# EAGLE board Retro_Lite_CM5_IO_X2.2 (EAGLE 9.6.1), part 1 of 8
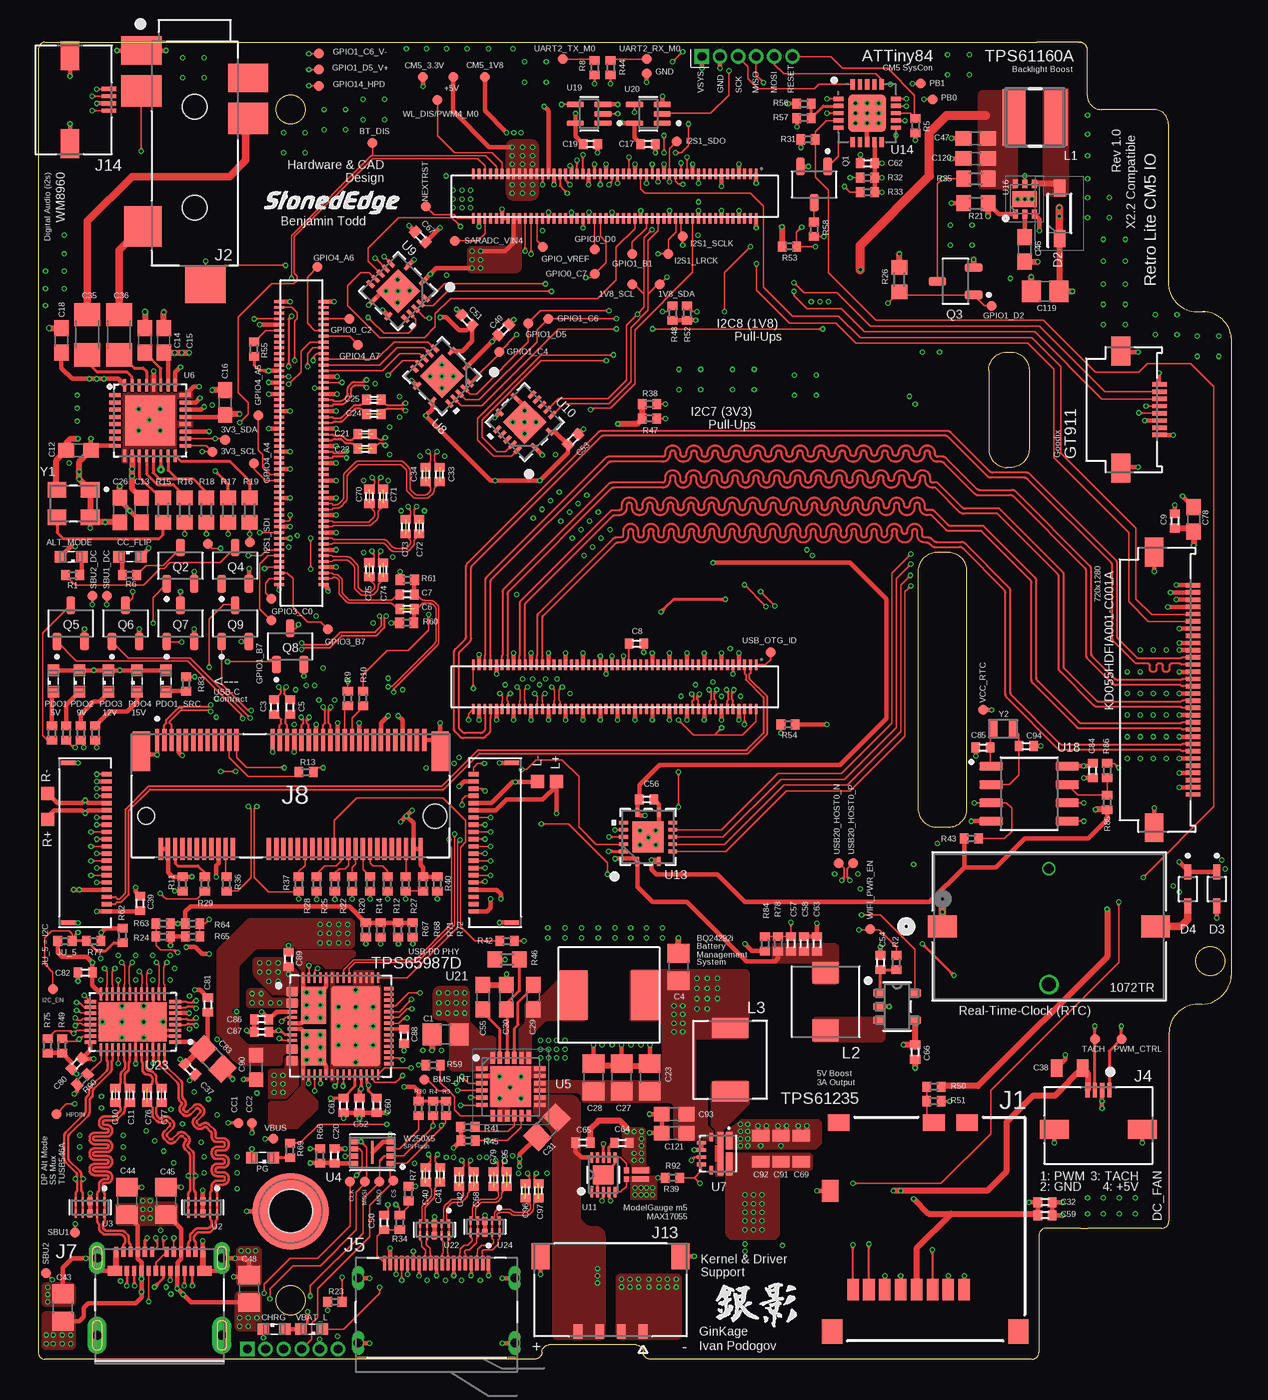
[diagram p10: board, top side]
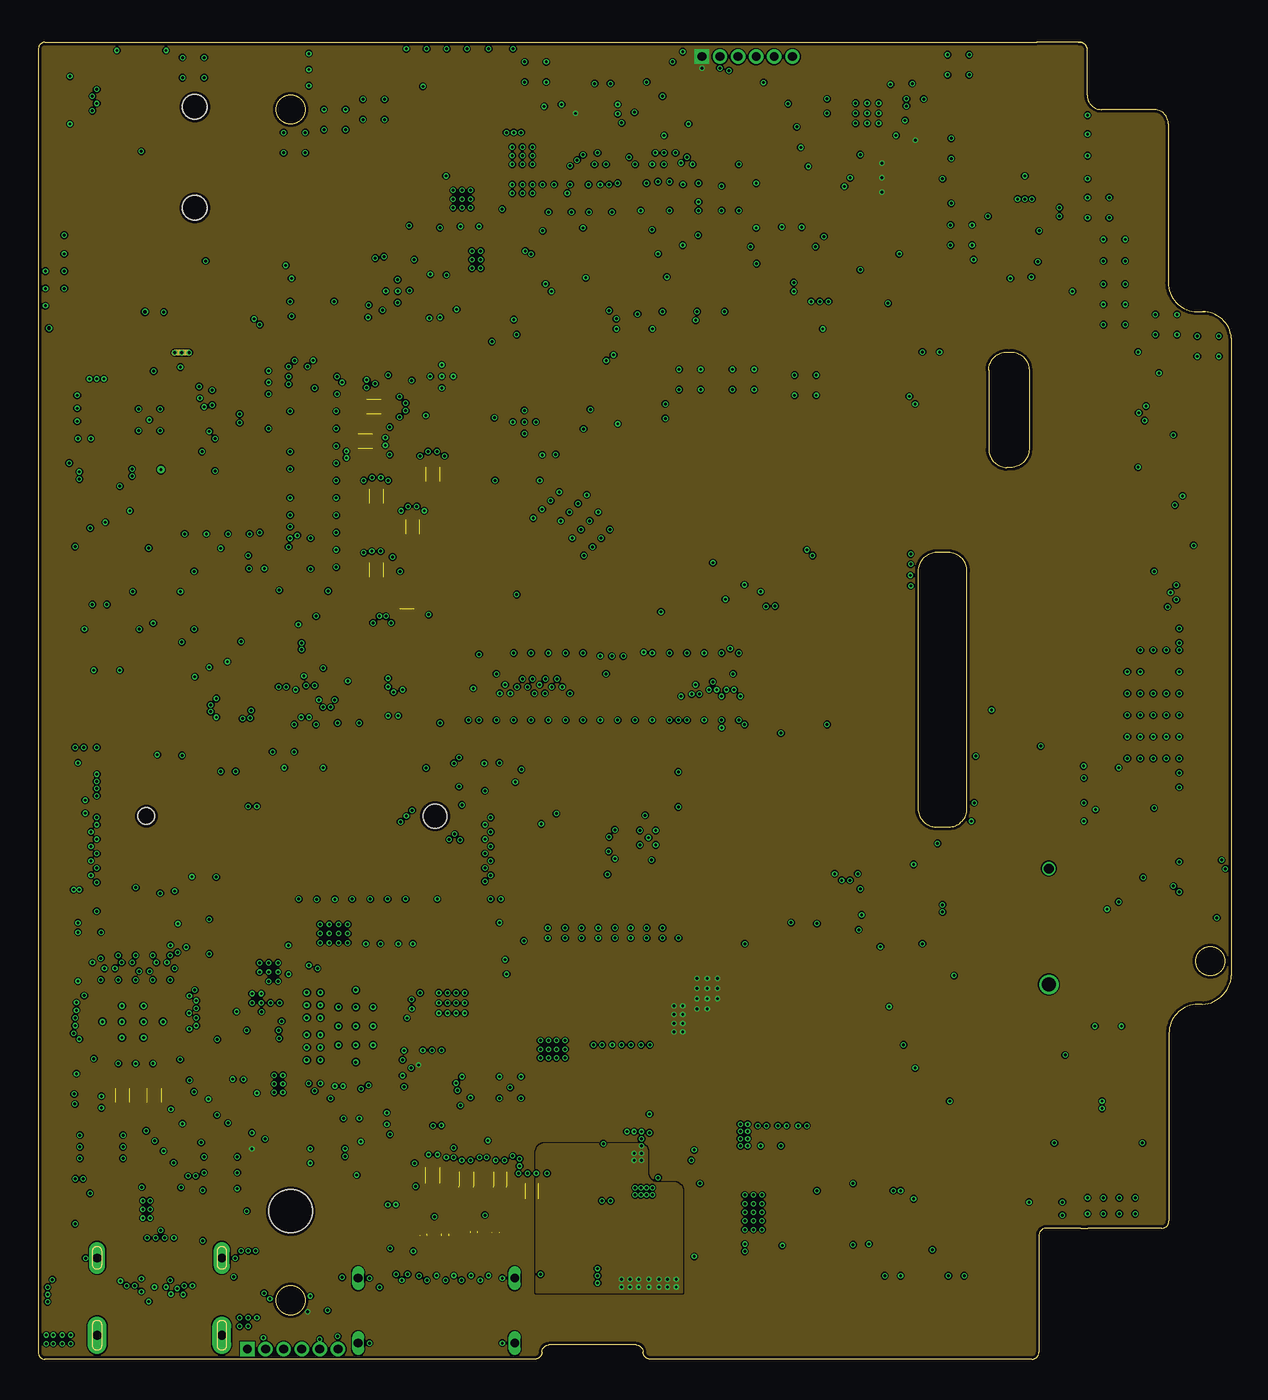
[diagram p11: board, inner layer GroundPlane1]
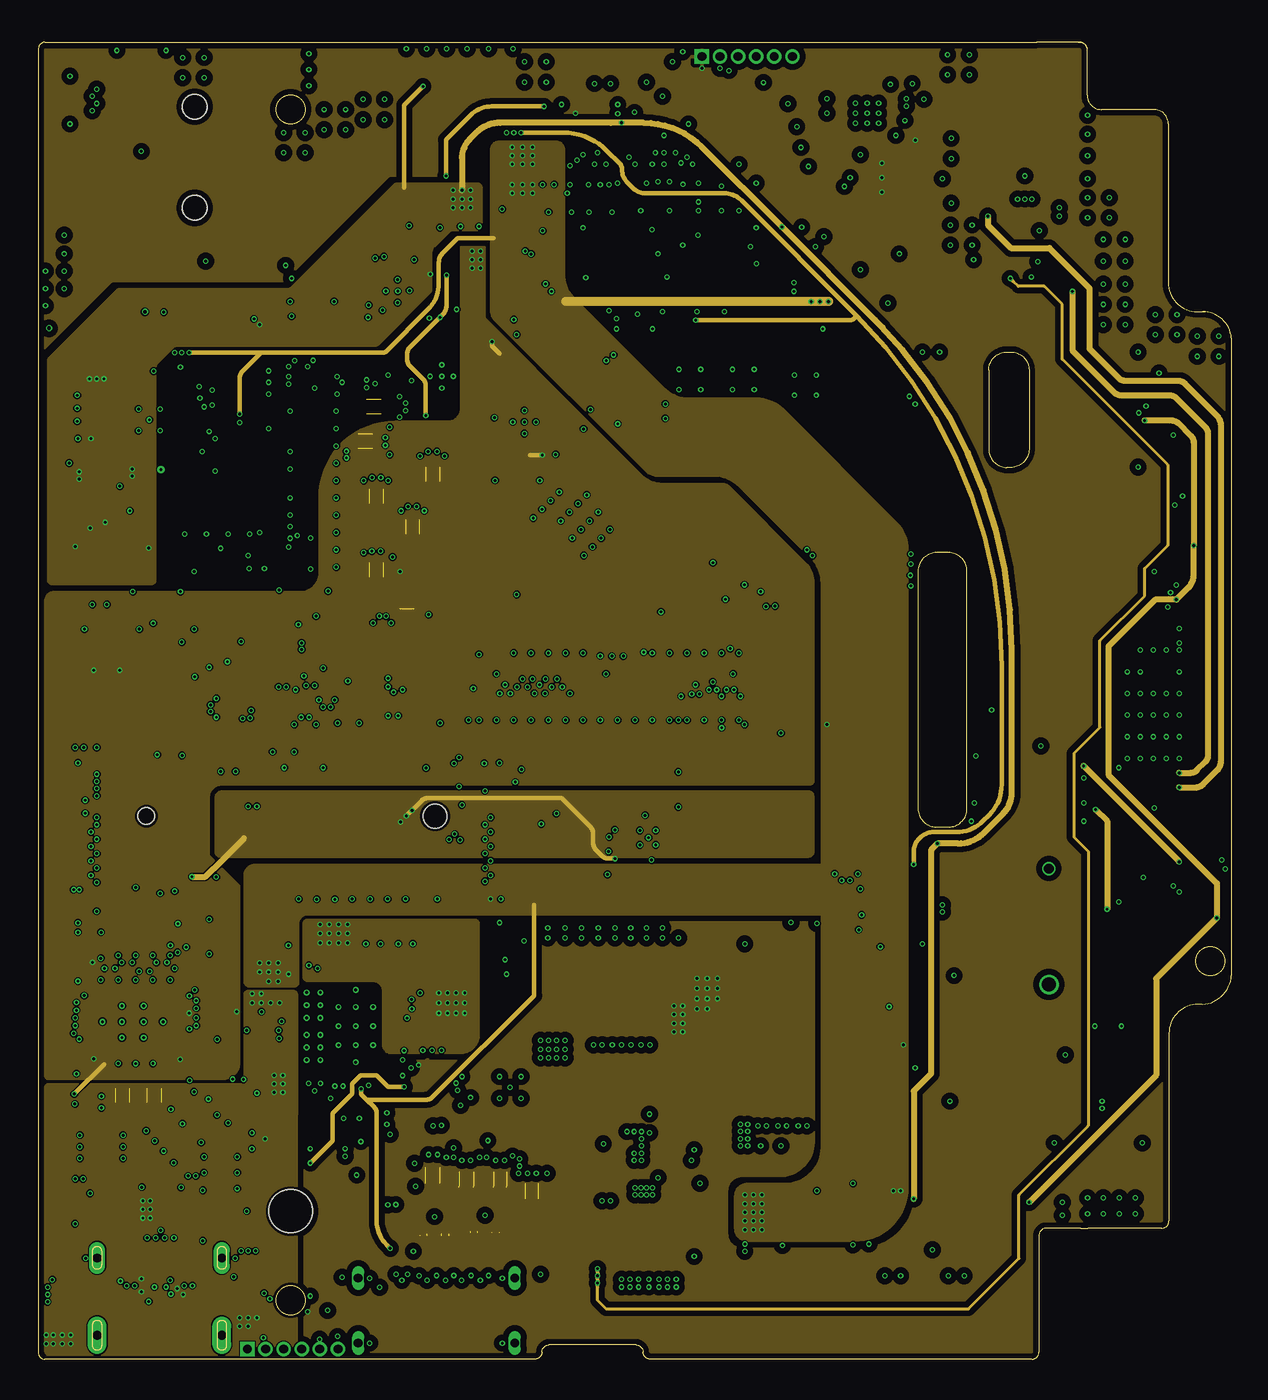
[diagram p12: board, inner layer PowerPlane]
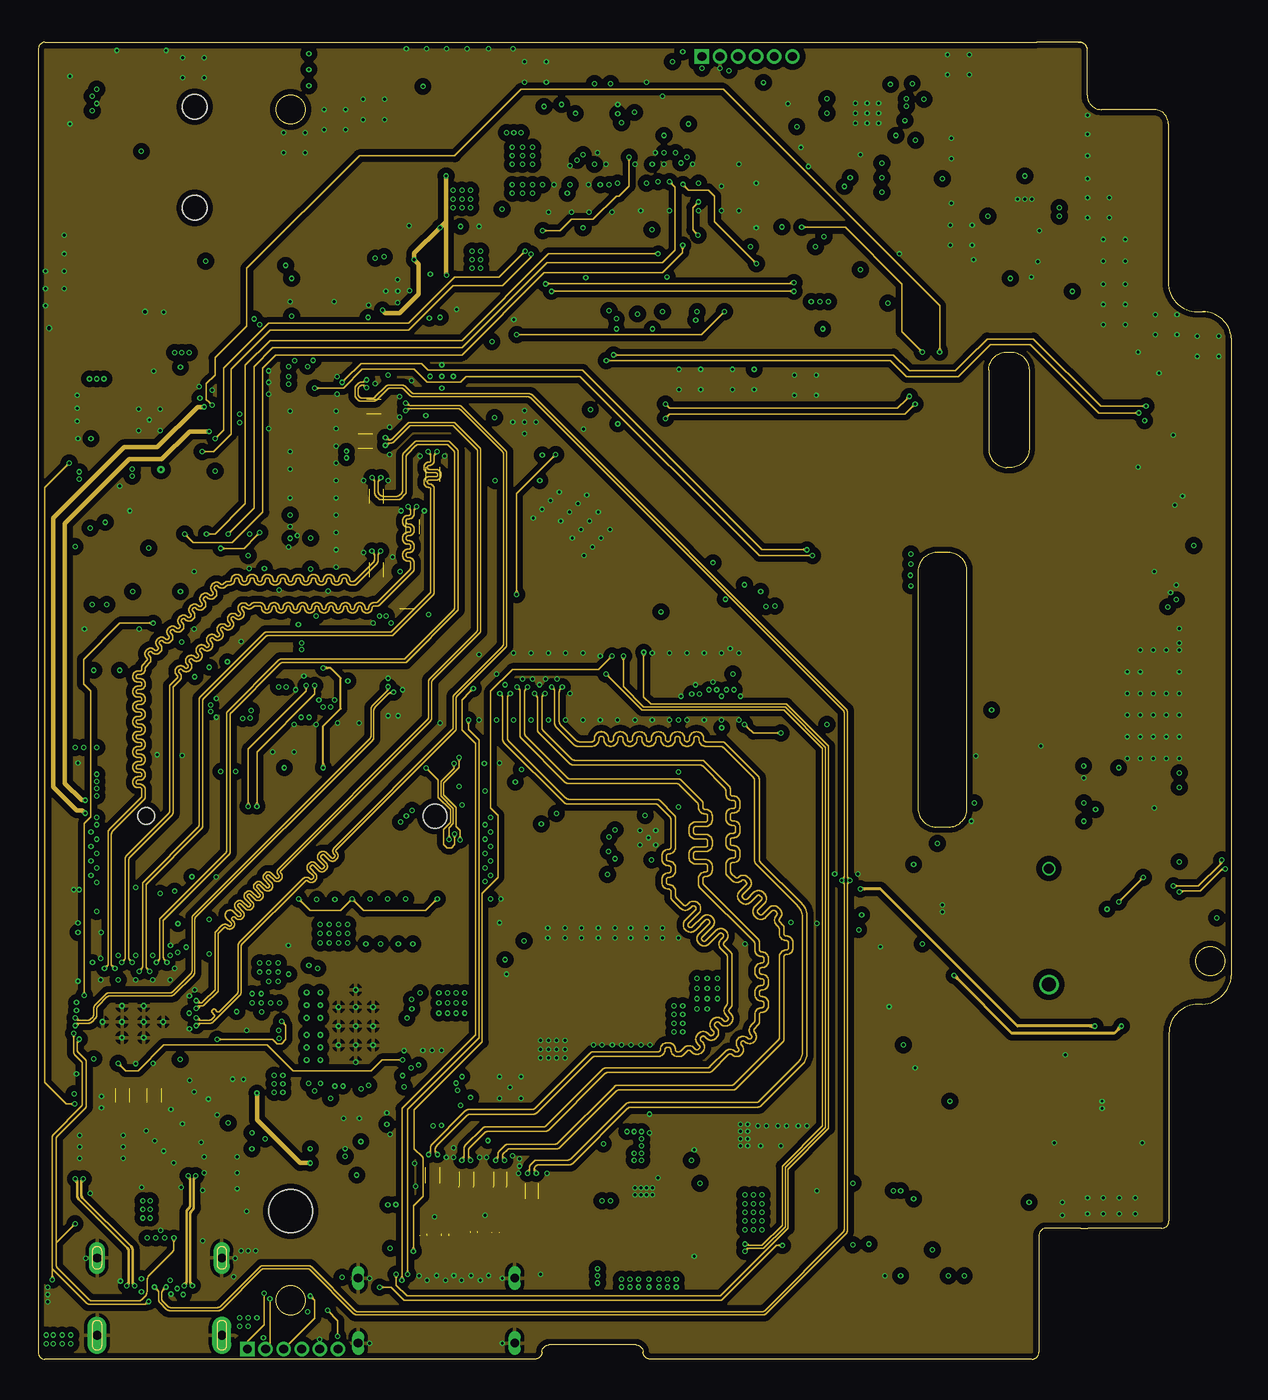
[diagram p13: board, inner layer MiddleSignal]
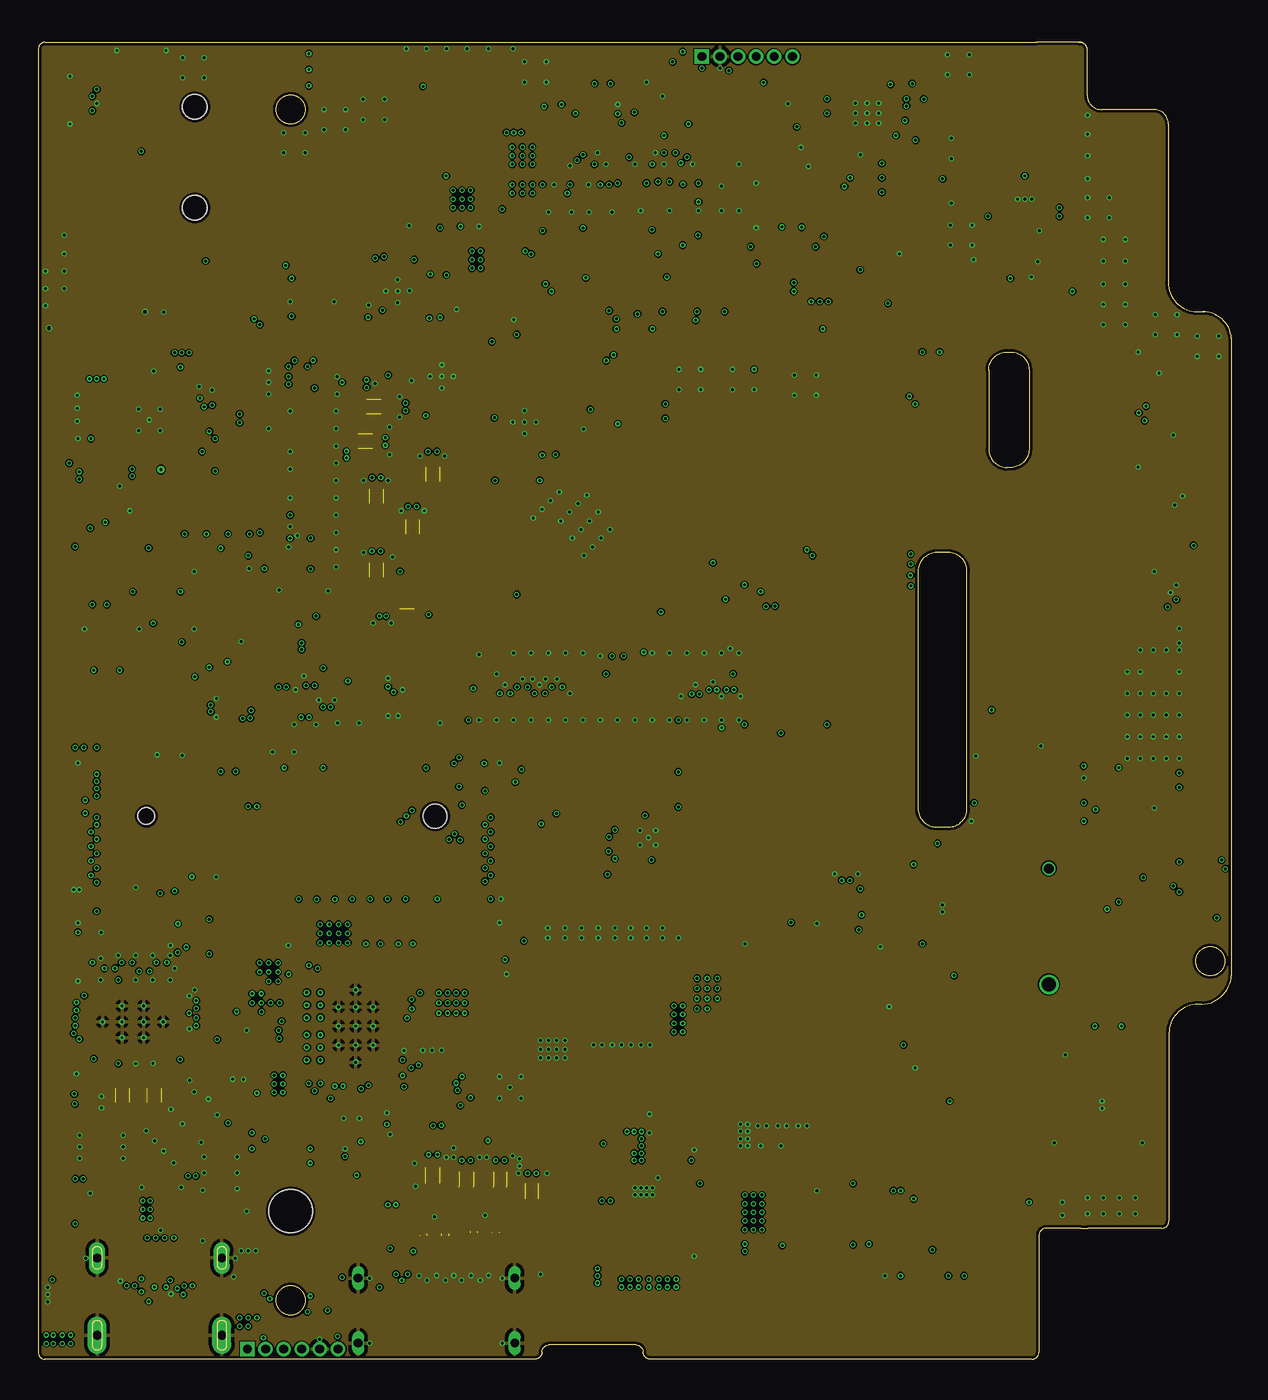
[diagram p14: board, inner layer GroundPlane2]
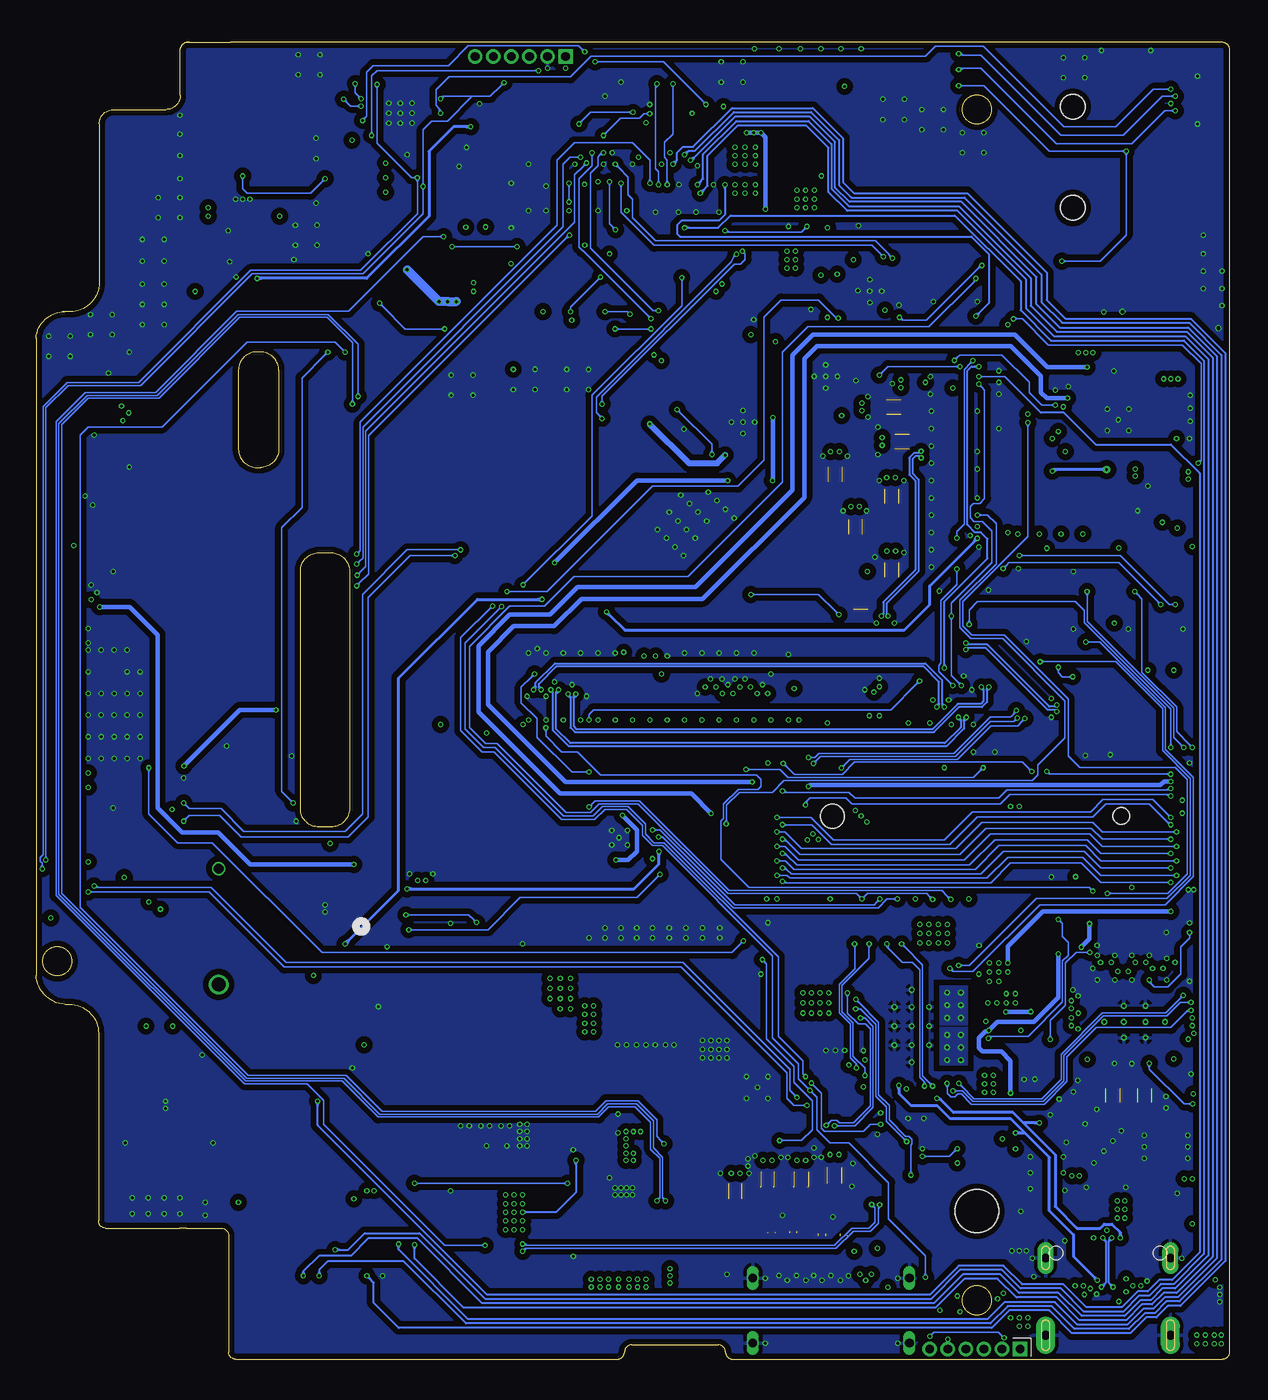
[diagram p15: board, bottom side, seen from below]

Size 82.67 x 91.25 mm. Coordinates in mm from the lower left corner, seen from the top.
Outline: 72.07,91.25 69.18,91.25 0.45,91.25 arc85 0,90.75 0,0.5 arc90 0.45,0 34.4,0 arc90 34.9,0.5 arc-90 35.4,1 41.4,1 arc-90 41.9,0.5 arc90 42.4,0 68.83,0 arc90 69.33,0.5 69.33,8.58 arc-90 69.83,9.08 72.22,9.08 72.72,9.08 77.84,9.08 arc90 78.34,9.58 78.34,22.58 arc-90 80.34,24.58 80.64,24.58 arc84 82.67,26.6 82.67,70.75 arc85 80.67,72.58
Outline: 72.07,91.25 arc-85 72.67,90.79
Outline: 80.67,72.58 80.86,72.57
Outline: 72.67,90.79 arc85 72.07,91.25
Outline: 80.67,72.58 80.29,72.58 arc-90 78.29,74.58 78.29,85.58 arc90 77.29,86.58 73.67,86.58 arc-90 72.67,87.58 72.67,90.79
Outline: 80.67,72.58 80.86,72.58
Outline: 62.22,36.88 63.08,36.88 arc90 64.35,38.14 64.35,54.6 arc90 63.08,55.88 62.22,55.88 arc90 60.95,54.6 60.95,38.14 arc90 62.22,36.88
Outline: 65.85,68.51 65.85,63.05 arc90 67.12,61.78 67.38,61.78 arc90 68.65,63.05 68.65,68.51 arc90 67.38,69.78 67.12,69.78 arc90 65.85,68.51
Outline: circle at 81.2,27.58 radius 1
Outline: circle at 17.49,4.08 radius 1
Outline: circle at 17.49,4.08 radius 1
Outline: circle at 17.49,86.58 radius 1
Copper layers (1+2*3+14*15+16): TopSignal 0.035mm / dielectric 0.1164mm / GroundPlane1 0.0152mm / dielectric 0.13mm / PowerPlane 0.0152mm / dielectric 0.2028mm / MiddleSignal 0.0152mm / dielectric 0.13mm / GroundPlane2 0.0152mm / dielectric 0.1164mm / BottomSignal 0.035mm
Design rules "jlcpcb-6-layer *": minimum track width 3.5mil, minimum drill 0.2mm, track to track 3.5mil, track to pad 3.5mil, pad to pad 3.5mil, via to via 3.5mil, smd to smd 0mil, copper to edge 0.2mm, drill to drill 5mil, minimum pad ring 3mil, minimum via ring 3mil, stop-mask expansion 0mil, vias tented up to drill 100mil, thermal gap 10mil
Net classes: 1 USB2.0: width 0.124 mm, clearance 0.102 mm; 2 PCIE2.0: width 0.124 mm, clearance 0.102 mm; 3 eDP 4th Layer: width 0.113 mm, clearance 0.203 mm; 4 RX/TX Pairs: width 0.17 mm; 5 eDP 1st Layer: width 0.109 mm, clearance 0.127 mm; 6 HDMI0_CLK: width 0.108 mm, clearance 0.102 mm; 7 HDMI0_TX0: width 0.108 mm, clearance 0.102 mm; 8 HDMI0_TX1: width 0.108 mm, clearance 0.102 mm; 9 HDMI0_TX2: width 0.108 mm, clearance 0.102 mm; 10 MIPI: width 0.142 mm, clearance 0.203 mm; 11 eMMC HS400: width 0.131 mm; 12 HDMI 4th Layer: width 0.113 mm, clearance 0.203 mm; 13 USB2.0 4th Layer: width 0.106 mm, clearance 0.102 mm; 14 USB3.0: width 0.106 mm, clearance 0.102 mm
tKeepout: area 36.2,22.1 to 43,28.5; 70 lines
bKeepout: 4 lines
tRestrict: area 36.2,22 to 43,28.4; area 45.7,18.2 to 50.5,23.4; area 52.3,23.9 to 56.8,27.3; area 52.3,22.3 to 53.6,23.9; area 68.6,84.2 to 69.5,87.9
bRestrict: area 31,40.9 to 44.4,42.1; area 20.5,44 to 44,46.9; area 19.1,43.8 to 19.5,44.2

## Footprints (pad centres in the part's own frame; a part is rotated, then mirrored left to right if it is on the bottom)
TP07R = smd 0.7 x 0.7: TP 0,0
C0805 = smd 1.3 x 1.5: 1 -0.95,0; 2 0.95,0
C0402 = smd 0.6 x 0.7: 1 -0.5,0; 2 0.5,0
C0603 = smd 1.1 x 1: 1 -0.85,0; 2 0.85,0
C1206 = smd 1.6 x 1.8: 1 -1.4,0; 2 1.4,0
0805 = smd 0.8 x 1.2: 1 -0.9,0; 2 0.9,0
C0603' = smd 1 x 1: 1 -0.85,0; 2 0.85,0
0603 = smd 1.1 x 1: 1 -0.85,0; 2 0.85,0
SML0603 = smd 0.8 x 0.8: A 0.75,0; C -0.75,0
HRS_DF40C-100DS-0.4V(51) = smd 0.2 x 0.7: 1 -9.8,-1.54; 2 -9.8,1.54; 3 -9.4,-1.54; 4 -9.4,1.54; 5 -9,-1.54; 6 -9,1.54; 7 -8.6,-1.54; 8 -8.6,1.54; 9 -8.2,-1.54; 10 -8.2,1.54; 11 -7.8,-1.54; 12 -7.8,1.54; 13 -7.4,-1.54; 14 -7.4,1.54; 15 -7,-1.54; 16 -7,1.54; 17 -6.6,-1.54; 18 -6.6,1.54; 19 -6.2,-1.54; 20 -6.2,1.54; 21 -5.8,-1.54; 22 -5.8,1.54; 23 -5.4,-1.54; 24 -5.4,1.54; 25 -5,-1.54; 26 -5,1.54; 27 -4.6,-1.54; 28 -4.6,1.54; 29 -4.2,-1.54; 30 -4.2,1.54; 31 -3.8,-1.54; 32 -3.8,1.54; 33 -3.4,-1.54; 34 -3.4,1.54; 35 -3,-1.54; 36 -3,1.54; 37 -2.6,-1.54; 38 -2.6,1.54; 39 -2.2,-1.54; 40 -2.2,1.54; 41 -1.8,-1.54; 42 -1.8,1.54; 43 -1.4,-1.54; 44 -1.4,1.54; 45 -1,-1.54; 46 -1,1.54; 47 -0.6,-1.54; 48 -0.6,1.54; 49 -0.2,-1.54; 50 -0.2,1.54; 51 0.2,-1.54; 52 0.2,1.54; 53 0.6,-1.54; 54 0.6,1.54; 55 1,-1.54; 56 1,1.54; 57 1.4,-1.54; 58 1.4,1.54; 59 1.8,-1.54; 60 1.8,1.54; 61 2.2,-1.54; 62 2.2,1.54; 63 2.6,-1.54; 64 2.6,1.54; 65 3,-1.54; 66 3,1.54; 67 3.4,-1.54; 68 3.4,1.54; 69 3.8,-1.54; 70 3.8,1.54; 71 4.2,-1.54; 72 4.2,1.54; 73 4.6,-1.54; 74 4.6,1.54; 75 5,-1.54; 76 5,1.54; 77 5.4,-1.54; 78 5.4,1.54; 79 5.8,-1.54; 80 5.8,1.54; 81 6.2,-1.54; 82 6.2,1.54; 83 6.6,-1.54; 84 6.6,1.54; 85 7,-1.54; 86 7,1.54; 87 7.4,-1.54; 88 7.4,1.54; 89 7.8,-1.54; 90 7.8,1.54; 91 8.2,-1.54; 92 8.2,1.54; 93 8.6,-1.54; 94 8.6,1.54; 95 9,-1.54; 96 9,1.54; 97 9.4,-1.54; 98 9.4,1.54; 99 9.8,-1.54; 100 9.8,1.54
SOD3716X135N = smd 1.15 x 0.8: 1 -1.75,0; 2 1.75,0
SOD2512X115N = smd 1.05 x 0.5: A 1.185,0; C -1.185,0
WA-SMSI_9774015243 = smd 5.3 x 5.3: 1 0,0 | hole 3: 0,0
MOLEX_5025700893 = smd 0.8 x 1.5: 1 -2.7,4.2; 2 -1.6,4.2; 3 -0.5,4.2; 4 0.6,4.2; 5 1.7,4.2; 6 2.8,4.2; 7 3.9,4.2; 8 5,4.2 | smd 1.15 x 1.5: 9 6.575,-2.65 | smd 1.5 x 1.15: 10 -0.6,-7.375; P$3 -2.9,-7.375; P$5 6,-7.375 | smd 1.4 x 1.7: P$1 -6.45,7.1; P$2 6.45,7.1
CUI_SJ-43516-SMT = smd 2 x 2.8: 1 -7.15,-3.7; 6 -5.25,3.7 | smd 2.8 x 2.6: 2 5.05,-3.6 | smd 2.2 x 2.8: 3 -2.45,3.7; 4 -4.35,-3.7 | smd 2.6 x 2.8: 5 9.05,0.75 | hole 1.7: -3.25,0; 3.75,0
CON_5051100492_MOL = smd 0.3 x 1: 1 -0.75,2.45; 2 -0.25,2.45; 3 0.25,2.45; 4 0.75,2.45 | smd 2 x 1.3: P1 -3.05,-0.25; P2 3.05,-0.25
WURTH_685119136923 = smd 0.23 x 1: 1 3.6,0; 2 3.2,0; 3 2.8,0; 4 2.4,0; 5 2,0; 6 1.6,0; 7 1.2,0; 8 0.8,0; 9 0.4,0; 10 0,0; 11 -0.4,0; 12 -0.8,0; 13 -1.2,0; 14 -1.6,0; 15 -2,0; 16 -2.4,0; 17 -2.8,0; 18 -3.2,0; 19 -3.6,0 | drill 0.6 pad 0.762 long: S1 -5.425,-1.05; S2 -5.425,-5.55; S3 5.425,-5.55; S4 5.425,-1.05
CON_5034802000_MOL = smd 0.3 x 0.7: 1 -4.75,1.5; 2 -4.25,1.5; 3 -3.75,1.5; 4 -3.25,1.5; 5 -2.75,1.5; 6 -2.25,1.5; 7 -1.75,1.5; 8 -1.25,1.5; 9 -0.75,1.5; 10 -0.25,1.5; 11 0.25,1.5; 12 0.75,1.5; 13 1.25,1.5; 14 1.75,1.5; 15 2.25,1.5; 16 2.75,1.5; 17 3.25,1.5; 18 3.75,1.5; 19 4.25,1.5; 20 4.75,1.5 | smd 0.3 x 1: P1 -5.54,-1.15; P2 5.54,-1.15
MOLEX_105450-0101 = smd 0.3 x 0.7: A1 -3,3.77; A2 -2.5,3.77; A3 -2,3.77; A4 -1.5,3.77; A5 -1,3.77; A6 -0.5,3.77; A7 0.5,3.77; A8 1,3.77; A9 1.5,3.77; A10 2,3.77; A11 2.5,3.77; A12 3,3.77; B2 2.25,2.47; B3 1.75,2.47; B4 1.25,2.47; B5 0.75,2.47; B6 0.25,2.47; B7 -0.25,2.47; B8 -0.75,2.47; B9 -1.25,2.47; B10 -1.75,2.47; B11 -2.25,2.47 | smd 1 x 0.7: B1 3.1,2.47; B12 -3.1,2.47 | drill 0.6 pad 1.1 long: S1 -4.32,3.36; S2 4.32,3.36 | drill 0.6 pad 1.3 long: S3 -4.32,-2; S4 4.32,-2
AMPHENOL_MDT320E01001 = smd 0.3 x 1.55: 1 -9.25,5.275; 2 -9,-2.275; 3 -8.75,5.275; 4 -8.5,-2.275; 5 -8.25,5.275; 6 -8,-2.275; 7 -7.75,5.275; 8 -7.5,-2.275; 9 -7.25,5.275; 10 -7,-2.275; 11 -6.75,5.275; 12 -6.5,-2.275; 13 -6.25,5.275; 14 -6,-2.275; 15 -5.75,5.275; 16 -5.5,-2.275; 17 -5.25,5.275; 18 -5,-2.275; 19 -4.75,5.275; 20 -4.5,-2.275; 21 -4.25,5.275; 22 -4,-2.275; 23 -3.75,5.275; 32 -1.5,-2.275; 33 -1.25,5.275; 34 -1,-2.275; 35 -0.75,5.275; 36 -0.5,-2.275; 37 -0.25,5.275; 38 0,-2.275; 39 0.25,5.275; 40 0.5,-2.275; 41 0.75,5.275; 42 1,-2.275; 43 1.25,5.275; 44 1.5,-2.275; 45 1.75,5.275; 46 2,-2.275; 47 2.25,5.275; 48 2.5,-2.275; 49 2.75,5.275; 50 3,-2.275; 51 3.25,5.275; 52 3.5,-2.275; 53 3.75,5.275; 54 4,-2.275; 55 4.25,5.275; 56 4.5,-2.275; 57 4.75,5.275; 58 5,-2.275; 59 5.25,5.275; 60 5.5,-2.275; 61 5.75,5.275; 62 6,-2.275; 63 6.25,5.275; 64 6.5,-2.275; 65 6.75,5.275; 66 7,-2.275; 67 7.25,5.275; 68 7.5,-2.275; 69 7.75,5.275; 70 8,-2.275; 71 8.25,5.275; 72 8.5,-2.275; 73 8.75,5.275; 74 9,-2.275; 75 9.25,5.275 | smd 1.2 x 2.75: S1 -10.35,4.5; S2 10.35,4.5 | hole 1.15: -10,0 | hole 1.65: 10,0
CON_5051103091_MOL = smd 0.3 x 1: 1 -7.25,2.45; 2 -6.75,2.45; 3 -6.25,2.45; 4 -5.75,2.45; 5 -5.25,2.45; 6 -4.75,2.45; 7 -4.25,2.45; 8 -3.75,2.45; 9 -3.25,2.45; 10 -2.75,2.45; 11 -2.25,2.45; 12 -1.75,2.45; 13 -1.25,2.45; 14 -0.75,2.45; 15 -0.25,2.45; 16 0.25,2.45; 17 0.75,2.45; 18 1.25,2.45; 19 1.75,2.45; 20 2.25,2.45; 21 2.75,2.45; 22 3.25,2.45; 23 3.75,2.45; 24 4.25,2.45; 25 4.75,2.45; 26 5.25,2.45; 27 5.75,2.45; 28 6.25,2.45; 29 6.75,2.45; 30 7.25,2.45 | smd 2 x 1.3: P1 -9.55,-0.25; P2 9.55,-0.25
CON_5051100892_MOL = smd 0.3 x 1: 1 -1.75,2.45; 2 -1.25,2.45; 3 -0.75,2.45; 4 -0.25,2.45; 5 0.25,2.45; 6 0.75,2.45; 7 1.25,2.45; 8 1.75,2.45 | smd 2 x 1.3: P1 -4.05,-0.25; P2 4.05,-0.25
CONN_1072TR_KEY = smd 2.007 x 1.524: 1 0,0; 2 14.757,0 | drill 0.66 pad 0.66: 3 7.366,4.013 | drill 0.965 pad 0.965: 4 7.366,-4.013
MOLEX_5040500491 = smd 0.6 x 1: 1 2.25,-2.87; 2 0.75,-2.87; 3 -0.75,-2.87; 4 -2.25,-2.87 | smd 1.25 x 1.8: S1 4.855,2.32; S2 -4.855,2.32
R0402 = smd 0.6 x 0.7: 1 -0.5,0; 2 0.5,0
VLCF4020_1 = smd 3.9 x 1.6: 1 0,-1.45; 2 0,1.45
IND_AMDLA4530S-2R2MT = smd 1.5 x 1.8: 1 -2,0; 2 2,0
IND_SPM5020T-1R0M = smd 1.4 x 2.5: 1 -2.2,0; 2 2.2,0
ASPI-0630HI = smd 2 x 3.4: P$1 -2.5,0; P$2 2.5,0
TP09SQ = smd 0.9 x 0.9: TP 0,0
SOT95P280X125-3N = smd 1.21 x 0.59: 1 -1.255,0.95; 2 -1.255,-0.95; 3 1.255,0
R0603 = smd 1 x 1.1: 1 -0.85,0; 2 0.85,0
PS0306DRF7T0R01L = smd 0.4 x 1.2: 1 -0.3,-0.075; 4 0.3,-0.075 | smd 0.4 x 0.35: 2 -0.3,0.9; 3 0.3,0.9
IC_TPD4E05U06DQAR = smd 0.565 x 0.2: 1 -0.417,1; 2 -0.417,0.5; 4 -0.417,-0.5; 5 -0.417,-1; 6 0.417,-1; 7 0.417,-0.5; 9 0.417,0.5; 10 0.417,1 | smd 0.565 x 0.4: 3 -0.417,0; 8 0.417,0
PSON50P300X200X60-9N = smd 0.49 x 0.35: 1 -1.22,0.75; 2 -1.22,0.25; 3 -1.22,-0.25; 4 -1.22,-0.75; 5 1.22,-0.75; 6 1.22,-0.25; 7 1.22,0.25; 8 1.22,0.75 | smd 0.2 x 1.6: 9 0,0
QFN50P400X400X100-25N = smd 0.8 x 0.3: 1 -2,1.25; 2 -2,0.75; 3 -2,0.25; 4 -2,-0.25; 5 -2,-0.75; 6 -2,-1.25; 13 2,-1.25; 14 2,-0.75; 15 2,-0.25; 16 2,0.25; 17 2,0.75; 18 2,1.25 | smd 0.3 x 0.8: 7 -1.25,-2; 8 -0.75,-2; 9 -0.25,-2; 10 0.25,-2; 11 0.75,-2; 12 1.25,-2; 19 1.25,2; 20 0.75,2; 21 0.25,2; 22 -0.25,2; 23 -0.75,2; 24 -1.25,2 | smd 2.8 x 2.8: 25 0,0
QFN50P500X500X100-33N = smd 0.86 x 0.27: 1 -2.435,1.75; 2 -2.435,1.25; 3 -2.435,0.75; 4 -2.435,0.25; 5 -2.435,-0.25; 6 -2.435,-0.75; 7 -2.435,-1.25; 8 -2.435,-1.75; 17 2.435,-1.75; 18 2.435,-1.25; 19 2.435,-0.75; 20 2.435,-0.25; 21 2.435,0.25; 22 2.435,0.75; 23 2.435,1.25; 24 2.435,1.75 | smd 0.27 x 0.86: 9 -1.75,-2.435; 10 -1.25,-2.435; 11 -0.75,-2.435; 12 -0.25,-2.435; 13 0.25,-2.435; 14 0.75,-2.435; 15 1.25,-2.435; 16 1.75,-2.435; 25 1.75,2.435; 26 1.25,2.435; 27 0.75,2.435; 28 0.25,2.435; 29 -0.25,2.435; 30 -0.75,2.435; 31 -1.25,2.435; 32 -1.75,2.435 | smd 3.45 x 3.45: 33 0,0
CONV_TPS61235PRWLT = smd 1.24 x 0.44: 1 -0.9,0.77 | smd 3.04 x 0.44: 2 0,0.17 | smd 0.6 x 0.25: 3 -1.15,-0.475; 8 1.15,-0.475 | smd 0.25 x 0.6: 4 -0.75,-1.15; 5 -0.25,-1.15; 6 0.25,-1.15; 7 0.75,-1.15 | smd 1.59 x 0.44: 9 0.725,0.77
QFN14_3.5X3.5_UM3204_USC-L = smd 0.61 x 0.254: 1 -1.702,0.75; 2 -1.702,-0.75; 8 1.702,-0.75; 9 1.702,0.75 | smd 0.254 x 0.61: 3 -1,-1.702; 4 -0.5,-1.702; 5 0,-1.702; 6 0.5,-1.702; 7 1,-1.702; 10 1,1.702; 11 0.5,1.702; 12 0,1.702; 13 -0.5,1.702; 14 -1,1.702 | smd 2.134 x 2.134: 15 0,0
21-100013A_T102A2+1C_MXM = smd 0.711 x 0.203: 1 -1.194,0.8; 2 -1.194,0.4; 3 -1.194,0; 4 -1.194,-0.4; 5 -1.194,-0.8; 6 1.194,-0.8; 7 1.194,-0.4; 8 1.194,0; 9 1.194,0.4; 10 1.194,0.8 | smd 1.295 x 1.397: 11 0,0
SY8089AAAC_SGY-L = smd 0.8 x 0.457: 1 -1.251,0.95; 2 -1.251,0; 3 -1.251,-0.95; 4 1.251,-0.95; 5 1.251,0.95
QFN20G-0.5-4X4MM = smd 0.7 x 0.3: 1 -2,1; 2 -2,0.5; 3 -2,0; 4 -2,-0.5; 5 -2,-1; 11 2,-1; 12 2,-0.5; 13 2,0; 14 2,0.5; 15 2,1 | smd 0.3 x 0.7: 6 -1,-2; 7 -0.5,-2; 8 0,-2; 9 0.5,-2; 10 1,-2; 16 1,2; 17 0.5,2; 18 0,2; 19 -0.5,2; 20 -1,2 | smd 2.6 x 2.6: PAD 0,0
SON65P200X200X80-7N = smd 0.6 x 0.35: 1 -1.05,0.65; 2 -1.05,0; 3 -1.05,-0.65; 4 1.05,-0.65; 5 1.05,0; 6 1.05,0.65 | smd 1.1 x 1.7: 7 0,0
SOIC127P602X173-8N = smd 1.64 x 0.59: 1 -2.635,1.905; 2 -2.635,0.635; 3 -2.635,-0.635; 4 -2.635,-1.905; 5 2.635,-1.905; 6 2.635,-0.635; 7 2.635,0.635; 8 2.635,1.905
SOT65P210X110-5N = smd 1.19 x 0.4: 1 -0.96,0.65; 2 -0.96,0; 3 -0.96,-0.65; 4 0.96,-0.65; 5 0.96,0.65
IC_TPS65987DDHRSHR = smd 0.8 x 0.7: 1 -3.35,2.4; 3 -3.35,1.6; 11 -3.35,-1.6; 13 -3.35,-2.4 | smd 0.7 x 0.2: 5 -3.35,1; 6 -3.35,0.6; 7 -3.35,0.2; 8 -3.35,-0.2; 9 -3.35,-0.6; 10 -3.35,-1; 29 3.35,-2.6; 30 3.35,-2.2; 31 3.35,-1.8; 32 3.35,-1.4; 33 3.35,-1; 34 3.35,-0.6; 35 3.35,-0.2; 36 3.35,0.2; 37 3.35,0.6; 38 3.35,1; 39 3.35,1.4; 40 3.35,1.8; 41 3.35,2.2; 42 3.35,2.6 | smd 0.2 x 0.7: 15 -2.6,-3.35; 16 -2.2,-3.35; 17 -1.8,-3.35; 18 -1.4,-3.35; 19 -1,-3.35; 20 -0.6,-3.35; 21 -0.2,-3.35; 22 0.2,-3.35; 23 0.6,-3.35; 24 1,-3.35; 25 1.4,-3.35; 26 1.8,-3.35; 27 2.2,-3.35; 28 2.6,-3.35; 43 2.6,3.35; 44 2.2,3.35; 45 1.8,3.35; 46 1.4,3.35; 47 1,3.35; 48 0.6,3.35; 49 0.2,3.35; 50 -0.2,3.35; 51 -0.6,3.35; 52 -1,3.35; 53 -1.4,3.35; 54 -1.8,3.35; 55 -2.2,3.35; 56 -2.6,3.35 | smd 1.75 x 2.6: 57 -1.875,1.45 | drill 0.2 pad 0.4: 57_1 -2.35,2.325; 57_2 -2.35,1.45; 57_3 -2.35,0.575; 57_4 -1.4,0.575; 57_5 -1.4,1.45; 57_6 -1.4,2.325; 58_1 -2.35,-0.6; 58_2 -2.35,-1.475; 58_3 -2.35,-2.35; 58_4 -1.4,-2.35; 58_5 -1.4,-1.475; 58_6 -1.4,-0.6; 59_1 -0.15,1.32; 59_2 -0.15,0; 59_3 -0.15,-1.32; 59_4 1.05,-2.5; 59_5 1.05,-1.32; 59_6 1.05,0; 59_7 1.05,1.32; 59_8 1.05,2.5; 59_9 2.25,1.32; 59_10 2.25,0; 59_11 2.25,-1.32 | smd 1.75 x 2.55: 58 -1.875,-1.475 | smd 3.4 x 5.5: 59 1.05,0
QFN40P400X600X80-41N = smd 0.86 x 0.22: 1 -2.935,1.4; 2 -2.935,1; 3 -2.935,0.6; 4 -2.935,0.2; 5 -2.935,-0.2; 6 -2.935,-0.6; 7 -2.935,-1; 8 -2.935,-1.4; 21 2.935,-1.4; 22 2.935,-1; 23 2.935,-0.6; 24 2.935,-0.2; 25 2.935,0.2; 26 2.935,0.6; 27 2.935,1; 28 2.935,1.4 | smd 0.22 x 0.86: 9 -2.2,-1.935; 10 -1.8,-1.935; 11 -1.4,-1.935; 12 -1,-1.935; 13 -0.6,-1.935; 14 -0.2,-1.935; 15 0.2,-1.935; 16 0.6,-1.935; 17 1,-1.935; 18 1.4,-1.935; 19 1.8,-1.935; 20 2.2,-1.935; 29 2.2,1.935; 30 1.8,1.935; 31 1.4,1.935; 32 1,1.935; 33 0.6,1.935; 34 0.2,1.935; 35 -0.2,1.935; 36 -0.6,1.935; 37 -1,1.935; 38 -1.4,1.935; 39 -1.8,1.935; 40 -2.2,1.935 | smd 4.7 x 2.7: 41 0,0 | drill 0.2 pad 0.4: 42 -0.75,1.1; 43 0.75,1.1; 44 -2.1,0; 45 -0.75,0; 46 0.75,0; 47 2.1,0; 48 -0.75,-1.1; 49 0.75,-1.1
1MM_PIC-PROGRAMING_HEADER = drill 0.6 pad 1 square: 1 -1.25,1 | drill 0.6 pad 1: 2 0,1; 3 1.25,1; 4 2.5,1; 5 3.75,1; 6 5.02,1
M.2HOLE = drill 3.5 pad 5.5: P$1 0,0
OSC_ECS-2333-160-BN-TR = smd 1.3 x 1.1: 1 -1.15,-0.95; 2 1.15,-0.95; 3 1.15,0.95; 4 -1.15,0.95
XTAL_ECS-.327-12.5-12R-TR = smd 0.6 x 1.1: 1 -0.7,0; 2 0.7,0

## Placement (x,y rotation side)
1V8_SCL  TPTP07R  [TP07R]  41.15,74.48 0 top
1V8_SDA  TPTP07R  [TP07R]  43.05,74.48 0 top
3V3_SCL  TPTP07R  [TP07R]  12.05,62.88 0 top
3V3_SDA  TPTP07R  [TP07R]  12.95,63.68 0 top
+5V  TPTP07R  [TP07R]  28.75,88.85 180 top
BMS_INT  TPTP07R  [TP07R]  26.75,19.38 0 top
BT_DIS  TPTP07R  [TP07R]  23.15,84.25 180 top
C1  1µF  [C0805]  28.23,22.5 0 top
C3  100nF  [C0402]  16.35,45.18 90 top
C4  10µF  [C0805]  44.36,27.17 270 top
C5  100nF  [C0402]  17.45,45.18 90 top
C6  100nF  [C0402]  25.55,51.98 0 top
C7  100nF  [C0402]  25.55,52.98 0 top
C8  1uF  [C0402]  41.45,49.58 0 top
C9  100nF  [C0402]  78.75,58.08 270 top
C10  220nF  [C0402]  5.35,18.28 90 top
C11  220nF  [C0402]  6.35,18.28 90 top
C12  0.1uF  [C0603]  2.8,62.98 180 top
C13  0.1uF  [C0603]  7.15,58.83 270 top
C14  4.7uF  [C0603]  7.4,70.58 90 top
C15  4.7uF  [C0603]  8.7,70.58 90 top
C16  4.7uF  [C0603]  12.95,66.28 90 top
C17  0.1uF  [C0402]  42.25,84.18 0 top
C18  0.1uF  [C0603]  1.6,70.58 270 top
C19  0.1uF  [C0402]  38.25,84.18 180 top
C20  0.1uF  [C0402]  20.52,14.09 270 top
C21  100nF  [C0402]  22.65,64.08 180 top
C22  100nF  [C0402]  22.65,63.08 180 top
C23  10µF  [C0805]  42.37,19.53 270 top
C24  100nF  [C0402]  23.25,65.48 0 top
C25  100nF  [C0402]  23.25,66.48 0 top
C26  0.1uF  [C0603]  5.65,58.83 270 top
C27  10µF  [C0805]  40.42,19.53 270 top
C28  10µF  [C0805]  38.47,19.53 270 top
C29  0.047µF  [C0603]  34.3,25.08 90 top
C30  1uF  [C0603]  32.42,25.08 270 top
C31  10µF  [C0805]  35.25,16.08 45 top
C32  100nF  [C0402]  69.75,10.88 180 top
C33  100nF  [C0402]  27.79,61.3 270 top
C34  100nF  [C0402]  26.84,61.3 270 top
C35  100uF  [C1206]  3.4,70.98 90 top
C36  100uF  [C1206]  5.6,70.98 90 top
C37  100nF  [C0402]  10.52,20.08 135 top
C38  10uF  [0805]  71.45,20.18 0 top
C39  0.1uF  [C0402]  7.05,31.58 90 top
C40  220nF  [C0402]  26.85,12.78 90 top
C41  220nF  [C0402]  27.85,12.78 90 top
C42  220nF  [C0402]  29.15,12.48 90 top
C43  10nF  [C0805]  1.71,3.58 270 top
C44  10nF  [C0805]  6.15,10.98 270 top
C45  10nF  [C0805]  8.85,10.98 270 top
C46  220nF  [C0603]  68.35,76.88 90 top
C47  1µF  [C0603]  64.95,84.58 180 top
C48  10nF  [C0805]  14.61,4.88 270 top
C49  100nF  [C0402]  32.25,71.32 225 top
C50  1uF  [C0402]  23.95,9.48 270 top
C51  100nF  [C0402]  29.71,71.98 315 top
C52  22uF  [C0402]  22.25,17.58 90 top
C53  100nF  [C0402]  37.05,63.72 225 top
C54  0.1uF  [C0402]  58.35,27.48 90 top
C55  1uF  [C0603]  30.8,25.08 270 top
C56  100nF  [C0402]  42.15,38.78 180 top
C57  100pF  [C0402]  52.15,28.78 90 top
C58  10uF  [C0402]  53.05,28.78 90 top
C59  10uF  [C0402]  69.75,9.98 180 top
C60  220pF  [C0402]  23.45,17.58 90 top
C61  220pF  [C0402]  21.15,17.58 90 top
C62  0.1uF  [C0402]  57.45,82.85 0 top
C63  100nF  [C0402]  53.95,28.78 90 top
C64  0.47uF  [C0402]  40.45,14.98 0 top
C65  0.1uF  [C0402]  37.74,15.01 0 top
C66  10uF  [C0402]  60.75,21.28 270 top
C67  100nF  [C0402]  26.48,77.75 315 top
C68  220nF  [C0402]  30.15,12.48 90 top
C69  22uF  [0805]  52.85,14.58 90 top
C70  100nF  [C0402]  22.94,59.78 270 top
C71  100nF  [C0402]  23.89,59.78 270 top
C72  100nF  [C0402]  26.39,57.68 270 top
C73  100nF  [C0402]  25.44,57.68 270 top
C74  100nF  [C0402]  23.89,54.68 270 top
C75  100nF  [C0402]  22.94,54.7 270 top
C76  220nF  [C0402]  7.55,18.28 90 top
C77  220nF  [C0402]  8.55,18.28 90 top
C78  10uF  [C0603]  80.05,58.18 270 top
C79  220nF  [C0402]  31.55,12.48 90 top
C80  100nF  [C0402]  2.67,20.47 45 top
C81  100nF  [C0402]  11.75,24.55 270 top
C82  100nF  [C0402]  3.26,26.8 0 top
C83  10uF  [C0805]  12.09,20.8 135 top
C84  100nF  [C0402]  73.05,40.78 90 top
C85  12pF  [C0402]  65.45,42.38 180 top
C86  10uF  [C0402]  15.47,23.55 0 top
C87  10uF  [C0402]  15.47,22.68 0 top
C88  4.7uF  [C0402]  25.35,22.38 90 top
C89  10uF  [C0402]  17.34,27.71 90 top
C90  47uF  [C0603']  15.1,20.23 270 top
C91  22uF  [0805]  51.45,14.58 90 top
C92  22uF  [0805]  50.05,14.58 90 top
C93  1.0uF  [0603]  44.05,16.98 180 top
C94  100nF  [C0402]  68.45,42.48 0 top
C95  220nF  [C0402]  32.45,12.48 90 top
C96  220nF  [C0402]  33.75,11.68 90 top
C97  220nF  [C0402]  34.65,11.68 90 top
C119  4.7µF 50v  [C0805]  69.75,73.98 180 top
C120  1µF  [C0603]  64.95,83.18 180 top
C121  10uF  [0603]  44.05,15.68 180 top
CC1  PTR1TP07R  [TP07R]  13.86,16.36 0 top
CC2  PTR1TP07R  [TP07R]  14.81,16.36 0 top
CHRG  [SML0603]  16.35,2.08 0 top
CLK  PTR1TP07R  [TP07R]  21.6,12.29 90 top
CM5_1V8  TPTP07R  [TP07R]  30.95,88.85 180 top
CM5_3.3V  TPTP07R  [TP07R]  26.65,88.85 180 top
CONNECTOR1  DF40C-100DS-0.4V(51)  [HRS_DF40C-100DS-0.4V(51)]  39.94,80.58 180 top
CONNECTOR2  DF40C-100DS-0.4V(51)  [HRS_DF40C-100DS-0.4V(51)]  39.94,46.57 180 top
CONNECTOR3  DF40C-100DS-0.4V(51)  [HRS_DF40C-100DS-0.4V(51)]  18.24,63.48 90 top
CS  PTR1TP07R  [TP07R]  24.6,12.37 0 top
D2  MBR0540T1G  [SOD3716X135N]  70.75,79.38 90 top
D3  B5819WS-TP  [SOD2512X115N]  81.65,32.58 270 top
D4  B5819WS-TP  [SOD2512X115N]  79.65,32.58 270 top
GND  TPTP07R  [TP07R]  42.15,89.08 0 top
GPIO0_C2  TPTP07R  [TP07R]  21.55,72.08 0 top
GPIO0_C7  TPTP07R  [TP07R]  38.55,75.18 0 top
GPIO0_D0  TPTP07R  [TP07R]  38.55,76.88 0 top
GPIO1_B1  TPTP07R  [TP07R]  41.15,76.58 0 top
GPIO1_B7  TPTP07R  [TP07R]  16.15,51.18 180 top
GPIO1_C1  TPTP07R  [TP07R]  11.75,56.48 0 top
GPIO1_C4  TPTP07R  [TP07R]  31.95,69.78 0 top
GPIO1_C6  TPTP07R  [TP07R]  35.35,72.08 0 top
GPIO1_C6_V-  TPTP07R  [TP07R]  19.45,90.45 180 top
GPIO1_D2  TPTP07R  [TP07R]  66.05,72.98 0 top
GPIO1_D5  TPTP07R  [TP07R]  33.95,71.78 0 top
GPIO1_D5_V+  TPTP07R  [TP07R]  19.45,89.35 0 top
GPIO3_B7  TPTP07R  [TP07R]  20.05,50.58 0 top
GPIO3_C0  TPTP07R  [TP07R]  16.15,52.68 0 top
GPIO4_A4  TPTP07R  [TP07R]  14.95,62.08 90 top
GPIO4_A5  TPTP07R  [TP07R]  15.25,65.38 90 top
GPIO4_A6  TPTP07R  [TP07R]  19.35,75.68 0 top
GPIO4_A7  TPTP07R  [TP07R]  22.15,70.28 0 top
GPIO14_HPD  TPTP07R  [TP07R]  19.45,88.22 180 top
GPIO_VREF  TPTP07R  [TP07R]  34.95,77.05 180 top
H1  M2 x 1.5mm  [WA-SMSI_9774015243]  17.48,10.26 0 top
HPDIN  PTR1TP07R  [TP07R]  1.25,16.98 0 top
I2C_EN  PTR1TP07R  [TP07R]  1.01,25.62 0 top
I2S1_LRCK  TPTP07R  [TP07R]  43.65,76.58 0 top
I2S1_SCLK  TPTP07R  [TP07R]  44.65,77.78 0 top
I2S1_SDI  TPTP07R  [TP07R]  14.65,56.58 180 top
I2S1_SDO  TPTP07R  [TP07R]  44.25,84.38 0 top
J1  5025700893  [MOLEX_5025700893]  61.45,9.02 180 top
J2  SJ-43516-SMT  [CUI_SJ-43516-SMT]  10.84,83.52 270 top
J4  5051100492  [CON_5051100492_MOL]  73.45,16.18 0 top
J5  685119136923  [WURTH_685119136923]  27.59,6.67 0 top
J6  5034802000  [CON_5034802000_MOL]  31.65,35.78 90 top
J7  105450-0101  [MOLEX_105450-0101]  8.4,3.66 0 top
J8  MDT320E01001  [AMPHENOL_MDT320E01001]  17.49,37.63 0 top
J9  5051103091  [CON_5051103091_MOL]  77.56,46.37 270 top
J10  5051100892  [CON_5051100892_MOL]  75.25,65.78 270 top
J11  1072TR  [CONN_1072TR_KEY]  62.65,29.98 0 top
J12  5034802000  [CON_5034802000_MOL]  3.25,35.78 270 top
J13  5040500491  [MOLEX_5040500491]  39.65,4.8 0 top
J14  5051100492  [CON_5051100492_MOL]  2.45,87.25 270 top
JU_5  0  [R0402]  1.85,28.98 180 top
L1  22µH  [VLCF4020_1]  69.05,86.03 270 top
L2  2.2uH  [IND_AMDLA4530S-2R2MT]  54.55,24.78 90 top
L3  1uH  [IND_SPM5020T-1R0M]  47.94,20.75 90 top
L6  ASPI-0630HI  [ASPI-0630HI]  39.56,25.22 0 top
L+  TPSTP09SQ  [TP09SQ]  35.9,40.03 270 top
L-  TPSTP09SQ  [TP09SQ]  34.6,40.03 270 top
MISO  PTR1TP07R  [TP07R]  23.64,12.29 90 top
MOSI  PTR1TP07R  [TP07R]  22.62,12.29 270 top
NEXTRST  TPTP07R  [TP07R]  26.85,79.86 0 top
PB0  TPTP07R  [TP07R]  61.95,87.28 0 top
PB1  TPTP07R  [TP07R]  61.15,88.38 0 top
PDO1  [SML0603]  1.05,46.98 90 top
PDO1_SRC  [SML0603]  8.85,46.98 90 top
PDO2  [SML0603]  2.85,46.98 90 top
PDO3  [SML0603]  4.85,46.98 90 top
PDO4  [SML0603]  6.85,46.98 90 top
PG  [SML0603]  15.55,13.98 180 top
PWM_CTRL  TPTP07R  [TP07R]  75.05,22.18 0 top
Q1  AO3400A  [SOT95P280X125-3N]  53.75,81.38 270 top
Q2  AO3400A  [SOT95P280X125-3N]  9.85,54.98 90 top
Q3  AO3400A  [SOT95P280X125-3N]  63.55,74.68 180 top
Q4  AO3400A  [SOT95P280X125-3N]  13.65,54.98 90 top
Q5  AO3400A  [SOT95P280X125-3N]  2.25,50.98 90 top
Q6  AO3400A  [SOT95P280X125-3N]  6.05,50.98 90 top
Q7  AO3400A  [SOT95P280X125-3N]  9.85,50.98 90 top
Q8  AO3400A  [SOT95P280X125-3N]  17.45,49.38 90 top
Q9  AO3400A  [SOT95P280X125-3N]  13.65,50.98 90 top
R1  10k  [R0402]  2.38,54.32 0 top
R2  10k  [R0402]  59.45,27.48 90 top
R3  3.3k  [R0402]  28.25,17.38 90 top
R4  3.3k  [R0402]  27.35,17.38 90 top
R5  4.7k  [R0402]  60.78,85.45 90 top
R6  10k  [R0402]  6.32,54.33 180 top
R7  47K  [R0402]  25.65,11.48 90 top
R8  100R  [R0402]  38.55,89.48 270 top
R9  22R  [R0402]  21.45,45.78 270 top
R10  22R  [R0402]  22.5,45.78 270 top
R11  10K  [R0402]  10,32.93 270 top
R12  22R  [R0402]  25.45,32.93 270 top
R13  0  [R0402]  18.55,40.68 180 top
R14  22R  [R0402]  24.2,32.93 270 top
R15  10R  [R0603]  8.65,58.83 90 top
R16  10R  [R0603]  10.15,58.83 90 top
R17  10R  [R0603]  13.15,58.83 90 top
R18  10R  [R0603]  11.65,58.83 90 top
R19  10R  [R0603]  14.65,58.83 90 top
R20  22R  [R0402]  23,32.93 270 top
R21  5Ω  [R0603]  64.95,80.08 180 top
R22  22R  [R0402]  21.75,32.93 270 top
R23  2.2k  [R0402]  20.55,3.98 180 top
R24  100k 1%  [R0402]  8.66,29.29 180 top
R25  22R  [R0402]  20.55,32.93 270 top
R26  10k  [R0603]  59.65,74.78 90 top
R27  10K  [R0402]  26.65,32.93 90 top
R28  22R  [R0402]  19.3,32.93 270 top
R29  22R  [R0402]  11.55,32.93 270 top
R30  3.3k  [R0402]  26.35,17.38 90 top
R31  10k  [R0402]  53.33,84.51 0 top
R32  4.7k  [R0402]  57.45,81.85 180 top
R33  4.7k  [R0402]  57.45,80.85 180 top
R34  0  [R0402]  25.05,9.48 90 top
R35  10k  [R0603]  64.95,81.78 0 top
R36  0  [R0402]  13.05,32.93 270 top
R37  22R  [R0402]  18.05,32.93 270 top
R38  1.8k  [R0402]  42.35,66.18 0 top
R39  PS0306DRF7T0R01L  [PS0306DRF7T0R01L]  41.65,12.78 90 top
R40  10K  [R0402]  27.65,32.93 90 top
R41  261Ω  [R0402]  29.76,16.09 0 top
R42  0  [R0402]  32.47,28.98 0 top
R43  47k  [R0402]  64.65,36.08 0 top
R44  100R  [R0402]  39.65,89.48 270 top
R45  10kΩ  [R0402]  29.78,15.15 0 top
R46  10kΩ  [R0603]  32.47,27.7 0 top
R47  1.8k  [R0402]  42.35,65.18 0 top
R48  1.8k  [R0402]  43.95,72.48 270 top
R49  2M  [R0402]  1.65,21.72 90 top
R50  100k  [R0402]  62.05,18.88 0 top
R51  0R  [R0402]  62.05,17.88 0 top
R52  1.8k  [R0402]  44.95,72.48 270 top
R53  1.8k  [R0402]  52.05,77.08 0 top
R54  0R  [R0402]  51.95,43.98 0 top
R55  100R  [R0402]  14.95,69.98 270 top
R56  10k  [R0402]  53.05,86.98 0 top
R57  27.4k  [R0402]  53.05,85.98 180 top
R58  2.2k  [R0402]  53.75,78.28 270 top
R59  4.7k  [R0402]  27.35,20.38 0 top
R60  100K  [R0402]  25.53,51.02 0 top
R61  100K  [R0402]  25.57,54 0 top
R62  10K  [R0402]  5.84,29.35 270 top
R63  10k 1%  [R0402]  8.66,30.18 0 top
R64  100k 1%  [R0402]  10.69,30.18 180 top
R65  100k 1%  [R0402]  10.69,29.29 0 top
R66  3.3k  [R0402]  19.53,14.09 270 top
R67  4.7k  [R0402]  22.7,29.74 90 top
R68  4.7k  [R0402]  23.71,29.74 90 top
R69  2.2k  [R0402]  17.45,14.48 270 top
R71  4.7k  [R0402]  24.92,29.74 90 top
R72  4.7k  [R0402]  25.94,29.74 90 top
R75  2M  [R0402]  0.65,21.72 90 top
R77  10k  [R0402]  3.85,28.98 180 top
R78  232k  [R0402]  51.25,28.78 270 top
R79  10k  [R0402]  0.95,43.38 90 top
R80  10k  [R0402]  1.95,43.38 90 top
R81  10k  [R0402]  2.95,43.38 90 top
R82  10k  [R0402]  3.95,43.38 90 top
R83  10k  [R0402]  10.25,46.78 270 top
R84  51k  [R0402]  50.35,28.78 90 top
R85  10k  [R0402]  74.05,38.58 270 top
R86  22R  [R0402]  74.05,40.78 90 top
R90  10K  [R0402]  3.05,19.38 45 top
R92  1M  [R0402]  43.95,12.58 0 top
R+  TPSTP09SQ  [TP09SQ]  0.65,37.38 270 top
R-  TPSTP09SQ  [TP09SQ]  0.65,39.18 90 top
SARADC_VIN4  TPTP07R  [TP07R]  28.85,77.48 0 top
SBU1  TPTP07R  [TP07R]  2.55,8.78 0 top
SBU1_DC  TPTP07R  [TP07R]  4.75,52.88 0 top
SBU2  TPTP07R  [TP07R]  0.55,5.98 0 top
SBU2_DC  TPTP07R  [TP07R]  3.75,52.88 0 top
SSMX_DP_ACTIVE  [SML0603]  2.28,55.59 180 top
SSMX_FLIP_ACTIVE  SSMX_FLIP  [SML0603]  6.35,55.6 0 top
TACH  TPTP07R  [TP07R]  73.2,22.18 0 top
U2  TPD4E05U06DQAR  [IC_TPD4E05U06DQAR]  11.4,10.52 270 top
U3  TPD4E05U06DQAR  [IC_TPD4E05U06DQAR]  3.59,10.52 270 top
U4  W25X05CLUXIGTR  [PSON50P300X200X60-9N]  23.15,14.33 180 top
U5  BQ24292I  [QFN50P400X400X100-25N]  32.74,18.88 0 top
U6  WM8960  [QFN50P500X500X100-33N]  7.75,65.03 0 top
U7  TPS61235PRWLT  [CONV_TPS61235PRWLT]  47.1,14.25 270 top
U8  UM3204QQFN14_3.5X3.5_UM3204_USC-L  [QFN14_3.5X3.5_UM3204_USC-L]  27.98,68.11 225 top
U9  UM3204QQFN14_3.5X3.5_UM3204_USC-L  [QFN14_3.5X3.5_UM3204_USC-L]  24.93,74 225 top
U10  UM3204QQFN14_3.5X3.5_UM3204_USC-L  [QFN14_3.5X3.5_UM3204_USC-L]  33.71,64.92 135 top
U11  MAX17055ETB+T  [21-100013A_T102A2+1C_MXM]  39.15,12.78 90 top
U12  SY8089AAACSY8089AAAC_SGY-L  [SY8089AAAC_SGY-L]  59.5,24.43 0 top
U13  UM3204QQFN14_3.5X3.5_UM3204_USC-L  [QFN14_3.5X3.5_UM3204_USC-L]  42.25,36.18 90 top
U14  MCU-ATTINY84A-MU(QFN20)  [QFN20G-0.5-4X4MM]  57.43,86.32 0 top
U16  TPS61160ADRVT  [SON65P200X200X80-7N]  68.35,80.38 90 top
U18  TSIC_306_SOP-8  [SOIC127P602X173-8N]  68.65,39.18 0 top
U19  SN74LVC1G17DCKR  [SOT65P210X110-5N]  38.17,86.28 180 top
U20  SN74LVC1G17DCKR  [SOT65P210X110-5N]  42.27,86.28 180 top
U21  TPS65987DDHRSHR  [IC_TPS65987DDHRSHR]  20.95,23.08 0 top
U22  TPD4E05U06DQAR  [IC_TPD4E05U06DQAR]  27.45,8.98 270 top
U23  TUSB546-DCIRNQT  [QFN40P400X600X80-41N]  6.55,23.38 180 top
U24  TPD4E05U06DQAR  [IC_TPD4E05U06DQAR]  30.95,9.18 270 top
U$3  6PINEADER  [1MM_PIC-PROGRAMING_HEADER]  47.23,91.25 180 bottom
U$7  M.2HOLE  [M.2HOLE]  -19.68,-9.24 0 bottom  (outside the outline)
U$11  6PINEADER  [1MM_PIC-PROGRAMING_HEADER]  15.75,-0.3 0 top
UART2_RX_M0  TPTP07R  [TP07R]  42.15,90.08 0 top
UART2_TX_M0  TPTP07R  [TP07R]  36.35,90.08 0 top
USB20_HOST0_N  TPTP07R  [TP07R]  55.45,34.38 180 top
USB20_HOST0_P  TPTP07R  [TP07R]  56.45,34.38 90 top
USB_OTG_ID  TPTP07R  [TP07R]  50.75,48.98 180 top
VBAT_L  [SML0603]  18.95,2.08 180 top
VBUS  PTR1TP07R  [TP07R]  16.31,15.29 0 top
VCC_RTC  TPTP07R  [TP07R]  65.45,44.98 90 top
WIFI_PWR_EN  TPTP07R  [TP07R]  57.65,29.78 0 top
WL_DIS/PWM4_M0  TPTP07R  [TP07R]  27.65,87.25 270 top
Y1  ECS-3225MV-240-BN-TR  [OSC_ECS-2333-160-BN-TR]  2.45,59.28 180 top
Y2  ECS-.327-12.5-12R-TR  [XTAL_ECS-.327-12.5-12R-TR]  66.85,43.68 180 top

## Tracks (layer width: path | path; a pad name or v marks a point on that pad's centre or on a via)
3V3  (via drill 0.2)
  TopSignal 0.305: J6.19 29.51,40.03 v29.15,39.67 | J12.2 v4.05,40.03
  BottomSignal 0.305: v29.15,39.67 29.05,39.77 4.78,39.77 4.52,40.03 v4.05,40.03
+5V  (via drill 0.2)
  TopSignal 0.152: U7.6 45.47,14 45.46,13.99 | 45.46,13.99 v45.25,13.78 | 45.46,13.99 45.21,13.87 | 45.21,13.87 | 45.46,13.99 45.34,13.74 | 45.34,13.74 | 45.46,13.99 45.21,13.87 | v45.25,13.78 45.21,13.87 | 45.46,13.99 45.34,13.74 | v45.25,13.78 45.34,13.74
  TopSignal 0.203: U21.25 22.37,19.71 22.37,19.04 | 22.37,19.04 v22.37,18.74 | 22.37,19.04 22.3,18.76 | v22.37,18.74 22.3,18.76 | 22.37,19.04 22.44,18.76 | v22.37,18.74 22.44,18.76 | 22.37,19.04 22.3,18.76 | 22.37,19.04 22.44,18.76 | 22.37,19.04 22.3,18.76 | v22.37,18.74 22.3,18.76 | 22.37,19.04 22.44,18.76 | v22.37,18.74 22.44,18.76
  TopSignal 0.305: C15.1 9,69.43 U6.26 | U6.21 12.8,65.28 C16.1 13,65.43 | C89.1 v17.34,26.68 | +5V.TP 28.75,86.48 31.25,83.98 v32.84,83.98 | C52.2 22.25,18.62 v22.37,18.74 | R54.2 v54.65,43.98 | J5.18 v24.39,7.68 | J12.20 | J12.20 v4.05,31.03 | J12.20 7,31.03 C39.1 | J6.1 31.1,31.03 31.35,31.28 v31.35,31.88
  TopSignal 0.406: v13.95,65.48 13.05,65.48 13,65.43 | C15.1 v9.95,69.73 v10.45,69.73 | U12.4 C66.1 v59.95,21.78 | J4.1 72.7,19.83 C38.2 70.45,18.28 68.95,18.28 67.1,16.43 67.1,13.03 65.75,11.68 v59.75,11.68 v59.25,11.68
  TopSignal 0.61: v56.95,75.48 56.95,77.18 61.75,81.98 61.75,84.98 62.95,86.18 65.65,86.18
  GroundPlane1 0.406: v9.45,69.73 v9.95,69.73 v10.45,69.73
  PowerPlane 0.305: 24.41,7.66 v24.39,7.68 24.13,7.94 arc-45 23.45,9.58 23.45,17.02 arc45 23.26,17.47 22.75,17.98 | v10.45,69.73 15.45,69.73 | 15.45,69.73 23.87,69.73 arc45 24.09,69.82 27,72.73 arc45 27.75,74.54 27.75,75.98 arc-45 28.04,76.67 29.05,77.68 31.55,77.68 | v13.95,65.48 13.95,67.97 arc-45 14.14,68.42 15.45,69.73 | 22.75,17.98 22.37,18.36 v22.37,18.74 | 22.75,17.98 26.89,17.98 arc45 27.34,18.17 34.35,25.18 34.35,31.48
  PowerPlane 0.61: v54.75,73.28 36.55,73.28
  BottomSignal 0.152: v45.25,13.78 45.25,13.48 | 45.25,13.48 45.25,11.58 46.65,10.18 48.65,10.18 | 48.65,10.18 v48.95,10.18 | 48.65,10.18 48.92,10.09 | v48.95,10.18 48.92,10.09 | 48.65,10.18 48.92,10.27 | v48.95,10.18 48.92,10.27 | 48.65,10.18 48.92,10.09 | 48.65,10.18 48.92,10.27 | 48.65,10.18 48.92,10.09 | v48.95,10.18 48.92,10.09 | 48.65,10.18 48.92,10.27 | v48.95,10.18 48.92,10.27 | 45.25,13.48 45.34,13.75 | v45.25,13.78 45.34,13.75 | 45.25,13.48 45.16,13.75 | v45.25,13.78 45.16,13.75 | 45.25,13.48 45.34,13.75 | 45.25,13.48 45.16,13.75 | 45.25,13.48 45.34,13.75 | v45.25,13.78 45.34,13.75 | 45.25,13.48 45.16,13.75 | v45.25,13.78 45.16,13.75
  BottomSignal 0.305: v15.34,27.46 15.34,28.59 12.9,31.03 v4.05,31.03
  BottomSignal 0.61: v53.55,73.28 v54.15,73.28 v54.75,73.28 v56.95,75.48
  other vias: 48.95,10.78 49.55,11.38 50.15,11.38 49.55,10.78 50.15,10.78 49.55,10.18 48.95,9.58 48.95,8.98 50.15,9.58 49.55,9.58 15.98,27.46 16.61,27.46 15.98,26.82 16.61,26.82 15.34,26.82 15.98,26.19 16.61,26.19 48.95,11.38 33.54,83.98 34.24,83.98 34.24,82.78 33.54,82.78 32.84,82.78 32.84,83.38 33.54,83.38 34.24,83.38 33.54,81.38 32.84,81.38 34.24,81.38 33.54,80.78 32.84,80.78 34.24,80.78 50.15,10.18 49.55,8.98 50.15,8.98
  pour TopSignal (no thermals): 18.01,26.72 18.01,25.5 arc-90 17.75,25.24 16.36,25.24 arc-45 16.18,25.32 15.13,26.36 arc-45 14.89,26.96 14.89,27.58 arc-90 15.14,27.84 16.89,27.84 arc-45 17.07,27.76 17.93,26.9 arc-45
  pour TopSignal: 66.75,87.93 68.35,87.93 68.35,84.53 67.85,84.03 67.85,81.4 arc-90 67.53,81.08 66.75,81.08
  pour TopSignal (no thermals): 65.15,87.56 65.15,81.4 arc90 65.47,81.08 67.53,81.08 arc90 67.85,81.4 67.85,87.56 arc90 67.53,87.88 65.47,87.88 arc90
  pour TopSignal (no thermals): 53.33,14.28 47.97,14.28 arc90 47.65,13.96 47.65,8.82 arc90 48.17,8.3 50.83,8.3 arc90 51.35,8.82 51.35,12.76 arc-90 51.67,13.08 53.33,13.08 arc90 53.65,13.4 53.65,13.96 arc90
  pour PowerPlane: 54.25,53.74 54.25,14.68 arc-90 51.75,12.18 49.12,12.18 arc90 48.25,11.31 48.25,9.05 arc90 49.12,8.18 56.55,8.18 arc90 60.25,11.88 60.25,56.14 arc45 59.52,57.91 51.58,65.85 arc45 49.81,66.58 45.09,66.58 arc-45 43.32,67.31 37.18,73.45 arc-45 36.45,75.22 36.45,83.81 arc90 35.88,84.38 31.92,84.38 arc90 31.35,83.81 31.35,72.57 arc45 31.56,72.07 42.14,61.49 arc45 42.89,61.18 46.81,61.18 arc-45 48.58,60.45 53.52,55.51 arc-45
  pour PowerPlane: 54.25,30.78 18.62,30.78 arc90 18.05,30.21 18.05,26.15 arc-90 17.68,25.78 14.72,25.78 arc-90 14.25,26.25 14.25,33.51 arc-90 15.02,34.28 54.25,34.28
  pour TopSignal (no thermals): 34.65,80.81 34.65,83.96 arc90 34.13,84.48 32.97,84.48 arc90 32.45,83.96 32.45,80.81 arc90 32.97,80.3 34.13,80.3 arc90
ADC
  TopSignal 0.203: U6.16 9.9,62.2 13.29,62.2 14.65,60.83 R19.2
ATTINY_SHUTDOWN  (via drill 0.2)
  TopSignal 0.102: U20.2 43.27,86.32 46.59,86.32 47.85,87.58 47.85,88.98 | 47.85,88.98 v47.85,89.28 | U14.11 59.43,85.08 | 59.43,85.08 v59.43,84.78 | 47.85,88.98 47.96,89.23 v47.85,89.28 | 47.85,88.98 47.74,89.23 v47.85,89.28 | 59.43,85.08 59.31,84.83 v59.43,84.78 | 59.43,85.08 59.54,84.83 v59.43,84.78
  BottomSignal 0.102: v47.85,89.28 48.15,89.28 | 48.15,89.28 59.05,89.28 59.43,88.9 59.43,85.08 | v59.43,84.78 59.43,85.08 | 48.15,89.28 47.9,89.39 v47.85,89.28 | 48.15,89.28 47.9,89.17 v47.85,89.28 | 59.43,85.08 59.31,84.83 v59.43,84.78 | 59.43,85.08 59.54,84.83 v59.43,84.78
BACKLIGHT_LED+  (via drill 0.2)
  TopSignal 0.305: J9.27 v79.05,40.62
  TopSignal 0.406: D2.1 70.75,74.03 C119.1 v71.65,73.98
  TopSignal 0.508: D2.1 v70.75,79.18 v70.75,79.78
  PowerPlane 0.406: v79.05,40.62 79.83,40.62 arc45 80.28,40.81 80.86,41.39 arc45 81.05,41.84 81.05,64.12 arc45 80.86,64.57 78.84,66.59 arc45 78.39,66.78 75.01,66.78 arc-45 74.56,66.97 71.65,69.88 v71.65,73.98
BACKLIGHT_LED-  (via drill 0.2)
  TopSignal 0.305: R21.1 66.55,79.33 U16.1 | J9.29 v79.05,39.62
  TopSignal 0.406: R21.1 v65.8,79.18
  PowerPlane 0.406: v79.05,39.62 80.23,39.62 arc45 80.68,39.81 81.66,40.79 arc45 81.95,41.48 81.95,64.68 arc45 81.66,65.37 79.44,67.59 arc45 78.99,67.78 75.31,67.78 arc-45 74.86,67.97 72.85,69.98 72.85,74.18 70.05,76.98 67.4,76.98 65.8,78.58 v65.8,79.18
BAT  (via drill 0.2)
  TopSignal 0.203: R57.2 52.55,85.68 | 52.55,85.68 v52.55,85.38 | 52.55,85.68 52.48,85.4 v52.55,85.38 | 52.55,85.68 52.62,85.4 v52.55,85.38
  TopSignal 0.305: U11.10 37.65,13.97 37.24,14.39 C65.1
  PowerPlane 0.203: 67.56,74.67 67.9,74.33 69.7,74.33 70.95,73.08 70.95,69.28 78.25,61.98 78.25,56.38 76.65,54.78 76.65,52.88 73.55,49.78 73.55,43.78 71.75,41.98 71.75,36.18 72.75,35.18 72.75,16.18 67.95,11.38 67.95,6.98 64.45,3.48 39.35,3.48 38.75,4.08 38.75,4.98 | 67.56,74.67 v67.35,74.88 | 38.75,4.98 v38.75,5.28 | v38.75,5.28 38.75,5.48 | 38.75,5.48 38.75,5.58 | 38.75,5.58 v38.75,5.78 | v38.75,5.78 38.75,5.98 | 38.75,5.98 38.75,6.08 | 38.75,6.08 v38.75,6.28 | 38.75,4.98 38.82,5.26 v38.75,5.28 | 38.75,4.98 38.68,5.26 v38.75,5.28 | 38.75,5.58 38.68,5.3 v38.75,5.28 | 38.75,5.58 38.82,5.3 v38.75,5.28 | 38.75,5.48 38.82,5.76 v38.75,5.78 | 38.75,5.48 38.68,5.76 v38.75,5.78 | 38.75,6.08 38.68,5.8 v38.75,5.78 | 38.75,6.08 38.82,5.8 v38.75,5.78 | 38.75,5.98 38.82,6.26 v38.75,6.28 | 38.75,5.98 38.68,6.26 v38.75,6.28 | 67.56,74.67 67.41,74.92 v67.35,74.88 | 67.56,74.67 67.31,74.82 v67.35,74.88
  BottomSignal 0.203: v52.55,85.38 52.85,85.38 | 52.85,85.38 53.75,85.38 55.45,83.68 55.45,79.18 59.75,74.88 67.05,74.88 | 67.05,74.88 v67.35,74.88 | 52.85,85.38 52.57,85.45 v52.55,85.38 | 52.85,85.38 52.57,85.31 v52.55,85.38 | 67.05,74.88 67.33,74.81 v67.35,74.88 | 67.05,74.88 67.33,74.95 v67.35,74.88
  pour TopSignal (no thermals): 34.34,18.28 36.82,18.28 arc-90 37.55,17.55 37.55,9.8 arc45 37.64,9.59 37.86,9.37 arc45 38.31,9.18 38.62,9.18 arc-90 39.25,8.54 39.25,1.7 arc-90 38.93,1.38 35.98,1.38 arc-90 35.66,1.7 35.66,15.21 arc45 35.29,16.11 34.34,17.05
BCLK
  TopSignal 0.203: U6.12 7.5,61.33 8.23,60.6 9.35,60.6 9.98,59.98 10.15,59.98 R16.2
BMS_INT
  TopSignal 0.102: U5.7 29.25,16.88 28.85,17.28 28.85,18.18 28.45,18.58 | 28.45,18.58 27.75,18.58 27,19.33 26.8,19.33 BMS_INT.TP | 28.45,18.58 27.85,19.18 R59.2
BMS_PG  (via drill 0.2)
  TopSignal 0.102: R69.1 18.15,14.98 19.45,16.28 v24.15,16.28
  BottomSignal 0.102: v28.95,19.13 28.25,18.43 28.25,15.98 28.05,15.78 25.35,15.78 24.85,16.28 v24.15,16.28
BMS_SDA/MOSI  (via drill 0.2)
  TopSignal 0.102: U5.6 30.69,17.58 29.55,17.58 | 29.55,17.58 v29.25,17.58 | 58.75,88.32 U14.16 58.45,88.34 58.45,88.65 58.05,89.05 51.65,89.05 50.98,89.72 U$3.5 | 58.75,88.32 v59.05,88.32 | v56.25,81.85 56.55,81.85 | 56.55,81.85 R32.2 | 29.55,17.58 29.3,17.69 | v29.25,17.58 29.3,17.69 | 29.55,17.58 29.3,17.47 | v29.25,17.58 29.3,17.47 | 29.55,17.58 29.3,17.69 | 29.55,17.58 29.3,17.47 | 29.55,17.58 29.3,17.69 | v29.25,17.58 29.3,17.69 | 29.55,17.58 29.3,17.47 | v29.25,17.58 29.3,17.47 | 58.75,88.32 | 58.75,88.32 59,88.2 | v59.05,88.32 59,88.2 | 58.75,88.32 | 58.75,88.32 59,88.43 | v59.05,88.32 59,88.43 | 58.75,88.32 59,88.2 | 58.75,88.32 59,88.43 | 58.75,88.32 59,88.2 | v59.05,88.32 59,88.2 | 58.75,88.32 59,88.43 | v59.05,88.32 59,88.43 | 56.55,81.85 56.3,81.96 | v56.25,81.85 56.3,81.96 | 56.55,81.85 56.3,81.74 | v56.25,81.85 56.3,81.74 | 56.55,81.85 56.3,81.96 | 56.55,81.85 56.3,81.74 | 56.55,81.85 56.3,81.96 | v56.25,81.85 56.3,81.96 | 56.55,81.85 56.3,81.74 | v56.25,81.85 56.3,81.74
  MiddleSignal 0.102: v82.25,33.98 82.04,33.98 81.96,33.9 | 81.96,33.9 80.52,32.46 79.34,32.46 | 79.34,32.46 79.13,32.46 v79.05,32.38 | 79.34,32.46 79.07,32.5 v79.05,32.38 | 79.34,32.46 79.13,32.28 v79.05,32.38 | 81.96,33.9 82.23,33.86 v82.25,33.98 | 81.96,33.9 82.17,34.08 v82.25,33.98
  BottomSignal 0.102: v29.25,17.58 29.55,17.58 | 29.55,17.58 30.15,17.58 30.65,18.08 30.65,19.83 38,27.18 65.47,27.18 70.67,32.38 78.75,32.38 | v59.05,88.32 59.05,88.02 | 59.05,88.02 59.05,84.25 56.65,81.85 56.55,81.85 | v56.25,81.85 56.55,81.85 | v56.25,81.85 56.25,81.55 | 56.25,81.55 56.25,79.38 60.19,75.44 67.8,75.44 75.57,67.67 80.51,67.67 82.17,66.01 82.17,34.96 82.37,34.76 82.37,34.5 82.25,34.38 82.25,34.28 | 78.75,32.38 v79.05,32.38 | 82.25,34.28 v82.25,33.98 | 29.55,17.58 29.3,17.69 | v29.25,17.58 29.3,17.69 | 29.55,17.58 29.3,17.47 | v29.25,17.58 29.3,17.47 | 29.55,17.58 29.3,17.69 | 29.55,17.58 29.3,17.47 | 29.55,17.58 29.3,17.69 | v29.25,17.58 29.3,17.69 | 29.55,17.58 29.3,17.47 | v29.25,17.58 29.3,17.47 | 59.05,88.02 59.16,88.27 | v59.05,88.32 59.16,88.27 | 59.05,88.02 58.94,88.27 | v59.05,88.32 58.94,88.27 | 59.05,88.02 59.16,88.27 | 59.05,88.02 58.94,88.27 | 59.05,88.02 59.16,88.27 | v59.05,88.32 59.16,88.27 | 59.05,88.02 58.94,88.27 | v59.05,88.32 58.94,88.27 | 56.55,81.85 56.3,81.96 | v56.25,81.85 56.3,81.96 | 56.55,81.85 56.3,81.74 | v56.25,81.85 56.3,81.74 | 56.25,81.55 56.36,81.8 | v56.25,81.85 56.36,81.8 | 56.25,81.55 56.14,81.8 | v56.25,81.85 56.14,81.8 | 56.55,81.85 56.3,81.96 | 56.55,81.85 56.3,81.74 | 56.55,81.85 56.3,81.96 | v56.25,81.85 56.3,81.96 | 56.55,81.85 56.3,81.74 | v56.25,81.85 56.3,81.74 | 56.25,81.55 56.36,81.8 | 56.25,81.55 56.14,81.8 | 56.25,81.55 56.36,81.8 | v56.25,81.85 56.36,81.8 | 56.25,81.55 56.14,81.8 | v56.25,81.85 56.14,81.8 | 78.75,32.38 | 78.75,32.38 79,32.27 | v79.05,32.38 79,32.27 | 78.75,32.38 | 78.75,32.38 79,32.49 | v79.05,32.38 79,32.49 | 78.75,32.38 79,32.27 | 78.75,32.38 79,32.49 | 78.75,32.38 79,32.27 | v79.05,32.38 79,32.27
  BottomSignal 0.102: 78.75,32.38 79,32.49 | v79.05,32.38 79,32.49 | 82.25,34.28 | 82.25,34.28 82.14,34.03 | v82.25,33.98 82.14,34.03 | 82.25,34.28 | 82.25,34.28 82.36,34.03 | v82.25,33.98 82.36,34.03 | 82.25,34.28 82.14,34.03 | 82.25,34.28 82.36,34.03 | 82.25,34.28 82.14,34.03 | v82.25,33.98 82.14,34.03 | 82.25,34.28 82.36,34.03 | v82.25,33.98 82.36,34.03
BMS_STAT  (via drill 0.2)
  TopSignal 0.102: U5.4 29.35,18.63 | 29.35,18.63 v29.05,18.63 | R23.1 21.05,5.38 | 21.05,5.38 v21.05,5.68 | 29.35,18.63 29.1,18.74 | v29.05,18.63 29.1,18.74 | 29.35,18.63 29.1,18.52 | v29.05,18.63 29.1,18.52 | 29.35,18.63 29.1,18.74 | 29.35,18.63 29.1,18.52 | 29.35,18.63 29.1,18.74 | v29.05,18.63 29.1,18.74 | 29.35,18.63 29.1,18.52 | v29.05,18.63 29.1,18.52 | 21.05,5.38 21.16,5.63 | v21.05,5.68 21.16,5.63 | 21.05,5.38 20.94,5.63 | v21.05,5.68 20.94,5.63 | 21.05,5.38 21.16,5.63 | 21.05,5.38 20.94,5.63 | 21.05,5.38 21.16,5.63 | v21.05,5.68 21.16,5.63 | 21.05,5.38 20.94,5.63 | v21.05,5.68 20.94,5.63 | v51.05,52.18 v50.05,53.18 | U9.12 26.79,72.13 v27.09,72.13
  BottomSignal 0.102: 28.84,18.42 28.55,18.13 28.55,15.88 27.65,14.98 26.35,14.98 23.6,12.23 23.6,9.73 21.05,7.18 21.05,5.98 | 28.84,18.42 v29.05,18.63 | v21.05,5.68 21.05,5.98 | 28.84,18.42 | 28.84,18.42 29.09,18.51 | v29.05,18.63 29.09,18.51 | 28.84,18.42 | 28.84,18.42 28.93,18.67 | v29.05,18.63 28.93,18.67 | 28.84,18.42 29.09,18.51 | 28.84,18.42 28.93,18.67 | 28.84,18.42 29.09,18.51 | v29.05,18.63 29.09,18.51 | 28.84,18.42 28.93,18.67 | v29.05,18.63 28.93,18.67 | 21.05,5.98 | 21.05,5.98 20.94,5.73 | v21.05,5.68 20.94,5.73 | 21.05,5.98 | 21.05,5.98 21.16,5.73 | v21.05,5.68 21.16,5.73 | 21.05,5.98 20.94,5.73 | 21.05,5.98 21.16,5.73 | 21.05,5.98 20.94,5.73 | v21.05,5.68 20.94,5.73 | 21.05,5.98 21.16,5.73 | v21.05,5.68 21.16,5.73 | v29.05,18.63 29.85,19.43 29.85,20.48 31.65,22.28 31.65,27.96 39.27,35.58 39.95,35.58 40.65,36.28 40.65,36.98 41.75,38.08 43.26,38.08 43.96,37.38 46.25,37.38 50.93,42.06 51.75,42.06 53.24,43.55 53.24,49.99 v51.05,52.18 | v50.05,53.18 47.25,53.18 39.95,60.48 34.05,60.48 32.25,62.28 32.25,72.18 31.05,73.38 28.45,73.38 27.2,72.13 v27.09,72.13
BMS_SW
  pour TopSignal (no thermals): 33.35,22.88 33.35,20.48 34.15,20.48 34.15,22.35 arc-45 34.24,22.57 35.06,23.39 arc-45 35.28,23.48 37.73,23.48 arc90 38.05,23.8 38.05,26.56 arc90 37.73,26.88 36.37,26.88 arc90 36.05,26.56 36.05,26.28 34.64,24.87 arc-45 34.42,24.78 34.07,24.78 arc90 33.75,24.46 33.75,23.41 arc-45 33.66,23.19
BT_HOST_WAKE  (via drill 0.2)
  TopSignal 0.102: R36.2 13.8,32.43 14.76,33.39 14.76,38.09 | 14.76,38.09 14.76,38.1 v14.55,38.31 | CONNECTOR3.85 18.85,70.47 18.2,69.83 18.2,68.39 17.56,67.76 | 17.56,67.76 | 17.56,67.76 v17.35,67.55 | 14.76,38.09 14.67,38.35 v14.55,38.31 | 14.76,38.09 14.51,38.19 v14.55,38.31 | 17.56,67.76 17.31,67.66 | v17.35,67.55 17.31,67.66 | 17.56,67.76 17.47,67.5 | v17.35,67.55 17.47,67.5 | 17.56,67.76 17.31,67.66 | v17.35,67.55 17.31,67.66 | 17.56,67.76 17.47,67.5 | v17.35,67.55 17.47,67.5
  MiddleSignal 0.102: v14.55,38.31 14.55,38.61 | 14.55,38.61 14.55,42.28 18.55,46.28 18.55,46.38 | 18.55,46.38 v18.55,46.68 | 14.55,38.61 | 14.55,38.61 14.44,38.36 | v14.55,38.31 14.44,38.36 | 14.55,38.61 | 14.55,38.61 14.66,38.36 | v14.55,38.31 14.66,38.36 | 14.55,38.61 14.44,38.36 | 14.55,38.61 14.66,38.36 | 14.55,38.61 14.44,38.36 | v14.55,38.31 14.44,38.36 | 14.55,38.61 14.66,38.36 | v14.55,38.31 14.66,38.36 | 18.55,46.38 18.66,46.63 | v18.55,46.68 18.66,46.63 | 18.55,46.38 18.44,46.63 | v18.55,46.68 18.44,46.63 | 18.55,46.38 18.66,46.63 | 18.55,46.38 18.44,46.63 | 18.55,46.38 18.66,46.63 | v18.55,46.68 18.66,46.63 | 18.55,46.38 18.44,46.63 | v18.55,46.68 18.44,46.63
  BottomSignal 0.102: v18.55,46.68 18.76,46.89 | 18.76,46.89 | 18.76,46.89 19.25,47.38 19.25,51.18 | 19.25,51.18 v19.25,51.48 | v19.25,51.48 19.25,51.78 | 19.25,51.78 19.25,52.38 16.45,55.18 16.45,57.38 17.1,58.03 17.68,58.03 17.95,58.3 17.95,59.08 17.73,59.3 17.29,59.3 16.95,59.64 16.95,67.14 17.14,67.33 | 17.14,67.33 v17.35,67.55 | 18.76,46.89 18.51,46.8 | v18.55,46.68 18.51,46.8 | 18.76,46.89 18.67,46.64 | v18.55,46.68 18.67,46.64 | 18.76,46.89 18.51,46.8 | v18.55,46.68 18.51,46.8 | 18.76,46.89 18.67,46.64 | v18.55,46.68 18.67,46.64 | 19.25,51.18 19.36,51.43 | v19.25,51.48 19.36,51.43 | 19.25,51.18 19.14,51.43 | v19.25,51.48 19.14,51.43 | 19.25,51.78 | 19.25,51.78 19.14,51.53 | v19.25,51.48 19.14,51.53 | 19.25,51.78 | 19.25,51.78 19.36,51.53 | v19.25,51.48 19.36,51.53 | 19.25,51.18 19.36,51.43 | 19.25,51.18 19.14,51.43 | 19.25,51.18 19.36,51.43 | v19.25,51.48 19.36,51.43 | 19.25,51.18 19.14,51.43 | v19.25,51.48 19.14,51.43 | 19.25,51.78 19.14,51.53 | 19.25,51.78 19.36,51.53 | 19.25,51.78 19.14,51.53 | v19.25,51.48 19.14,51.53 | 19.25,51.78 19.36,51.53 | v19.25,51.48 19.36,51.53 | 17.14,67.33 | 17.14,67.33 17.39,67.43 | v17.35,67.55 17.39,67.43 | 17.14,67.33 | 17.14,67.33 17.23,67.59 | v17.35,67.55 17.23,67.59 | 17.14,67.33 17.39,67.43 | 17.14,67.33 17.23,67.59 | 17.14,67.33 17.39,67.43 | v17.35,67.55 17.39,67.43 | 17.14,67.33 17.23,67.59 | v17.35,67.55 17.23,67.59
BT_REG_ON_H  (via drill 0.2)
  TopSignal 0.102: R40.1 27.65,32.18 | 27.65,32.18 v27.65,31.88 | R22.2 21.75,32.18 | 21.75,32.18 v21.75,31.88 | R37.2 18.05,32.38 | 18.05,32.38 18.05,32.18 | 18.05,32.18 v18.05,31.88 | 18.05,32.38 15.95,32.38 14.95,33.38 14.95,38.09 | 14.95,38.09 14.95,38.11 v15.15,38.31 | CONNECTOR3.98 17.56,72.88 17.93,72.5 17.93,72.1 17.75,71.92 17.75,69.48 | v18.87,56.88 18.87,56.58 | 18.87,56.58 18.87,55.06 | 18.87,55.06 v18.87,54.76 | 17.75,69.48 v17.75,69.18 | 27.65,32.18 | 27.65,32.18 27.54,31.93 | v27.65,31.88 27.54,31.93 | 27.65,32.18 | 27.65,32.18 27.76,31.93 | v27.65,31.88 27.76,31.93 | 27.65,32.18 27.54,31.93 | 27.65,32.18 27.76,31.93 | 27.65,32.18 27.54,31.93 | v27.65,31.88 27.54,31.93 | 27.65,32.18 27.76,31.93 | v27.65,31.88 27.76,31.93 | 21.75,32.18 | 21.75,32.18 21.64,31.93 | v21.75,31.88 21.64,31.93 | 21.75,32.18 | 21.75,32.18 21.86,31.93 | v21.75,31.88 21.86,31.93 | 21.75,32.18 21.64,31.93 | 21.75,32.18 21.86,31.93 | 21.75,32.18 21.64,31.93 | v21.75,31.88 21.64,31.93 | 21.75,32.18 21.86,31.93 | v21.75,31.88 21.86,31.93 | 18.05,32.18 | 18.05,32.18 17.94,31.93 | v18.05,31.88 17.94,31.93 | 18.05,32.18 | 18.05,32.18 18.16,31.93 | v18.05,31.88 18.16,31.93 | 18.05,32.18 17.94,31.93 | 18.05,32.18 18.16,31.93 | 18.05,32.18 17.94,31.93 | v18.05,31.88 17.94,31.93 | 18.05,32.18 18.16,31.93 | v18.05,31.88 18.16,31.93 | 14.95,38.09 15.2,38.19 v15.15,38.31 | 14.95,38.09 15.03,38.35 v15.15,38.31 | 17.75,69.48 | 17.75,69.48 17.64,69.23 | v17.75,69.18 17.64,69.23 | 17.75,69.48 | 17.75,69.48 17.86,69.23 | v17.75,69.18 17.86,69.23 | 17.75,69.48 17.64,69.23 | 17.75,69.48 17.86,69.23 | 17.75,69.48 17.64,69.23 | v17.75,69.18 17.64,69.23 | 17.75,69.48 17.86,69.23 | v17.75,69.18 17.86,69.23 | 18.87,56.58 18.99,56.83
  TopSignal 0.102: v18.87,56.88 18.99,56.83 | 18.87,56.58 18.76,56.83 | v18.87,56.88 18.76,56.83 | 18.87,56.58 18.99,56.83 | 18.87,56.58 18.76,56.83 | 18.87,56.58 18.99,56.83 | v18.87,56.88 18.99,56.83 | 18.87,56.58 18.76,56.83 | v18.87,56.88 18.76,56.83 | 18.87,55.06 | 18.87,55.06 18.76,54.81 | v18.87,54.76 18.76,54.81 | 18.87,55.06 | 18.87,55.06 18.99,54.81 | v18.87,54.76 18.99,54.81 | 18.87,55.06 18.76,54.81 | 18.87,55.06 18.99,54.81 | 18.87,55.06 18.76,54.81 | v18.87,54.76 18.76,54.81 | 18.87,55.06 18.99,54.81 | v18.87,54.76 18.99,54.81
  MiddleSignal 0.102: v27.65,31.88 27.44,31.67 | 27.44,31.67 26.85,31.08 22.55,31.08 21.96,31.67 | v21.75,31.88 21.96,31.67 | 21.96,31.67 | v18.05,31.88 18.26,31.67 | 18.26,31.67 | 18.26,31.67 18.85,31.08 20.95,31.08 21.54,31.67 | v21.75,31.88 21.54,31.67 | v15.15,38.31 15.15,38.61 | 15.15,38.61 15.15,42.08 19.15,46.08 19.15,46.38 | 19.15,46.38 v19.15,46.68 | 27.44,31.67 | 27.44,31.67 27.69,31.76 | v27.65,31.88 27.69,31.76 | 27.44,31.67 | 27.44,31.67 27.53,31.92 | v27.65,31.88 27.53,31.92 | 27.44,31.67 27.69,31.76 | 27.44,31.67 27.53,31.92 | 27.44,31.67 27.69,31.76 | v27.65,31.88 27.69,31.76 | 27.44,31.67 27.53,31.92 | v27.65,31.88 27.53,31.92 | 21.96,31.67 21.87,31.92 | v21.75,31.88 21.87,31.92 | 21.96,31.67 | 21.96,31.67 21.71,31.76 | v21.75,31.88 21.71,31.76 | 21.54,31.67 | 21.54,31.67 21.79,31.76 | v21.75,31.88 21.79,31.76 | 21.54,31.67 | 21.54,31.67 21.63,31.92 | v21.75,31.88 21.63,31.92 | 21.96,31.67 21.87,31.92 | 21.96,31.67 21.71,31.76 | 21.96,31.67 21.87,31.92 | v21.75,31.88 21.87,31.92 | 21.96,31.67 21.71,31.76 | v21.75,31.88 21.71,31.76 | 21.54,31.67 21.79,31.76 | 21.54,31.67 21.63,31.92 | 21.54,31.67 21.79,31.76 | v21.75,31.88 21.79,31.76 | 21.54,31.67 21.63,31.92 | v21.75,31.88 21.63,31.92 | 18.26,31.67 18.17,31.92 | v18.05,31.88 18.17,31.92 | 18.26,31.67 | 18.26,31.67 18.01,31.76 | v18.05,31.88 18.01,31.76 | 18.26,31.67 18.17,31.92 | 18.26,31.67 18.01,31.76 | 18.26,31.67 18.17,31.92 | v18.05,31.88 18.17,31.92 | 18.26,31.67 18.01,31.76 | v18.05,31.88 18.01,31.76 | 15.15,38.61 | 15.15,38.61 15.04,38.36 | v15.15,38.31 15.04,38.36 | 15.15,38.61 | 15.15,38.61 15.26,38.36 | v15.15,38.31 15.26,38.36 | 15.15,38.61 15.04,38.36 | 15.15,38.61 15.26,38.36 | 15.15,38.61 15.04,38.36 | v15.15,38.31 15.04,38.36
  MiddleSignal 0.102: 15.15,38.61 15.26,38.36 | v15.15,38.31 15.26,38.36 | 19.15,46.38 19.26,46.63 | v19.15,46.68 19.26,46.63 | 19.15,46.38 19.04,46.63 | v19.15,46.68 19.04,46.63 | 19.15,46.38 19.26,46.63 | 19.15,46.38 19.04,46.63 | 19.15,46.38 19.26,46.63 | v19.15,46.68 19.26,46.63 | 19.15,46.38 19.04,46.63 | v19.15,46.68 19.04,46.63